# Altium project RadioRepeater.PrjPcb
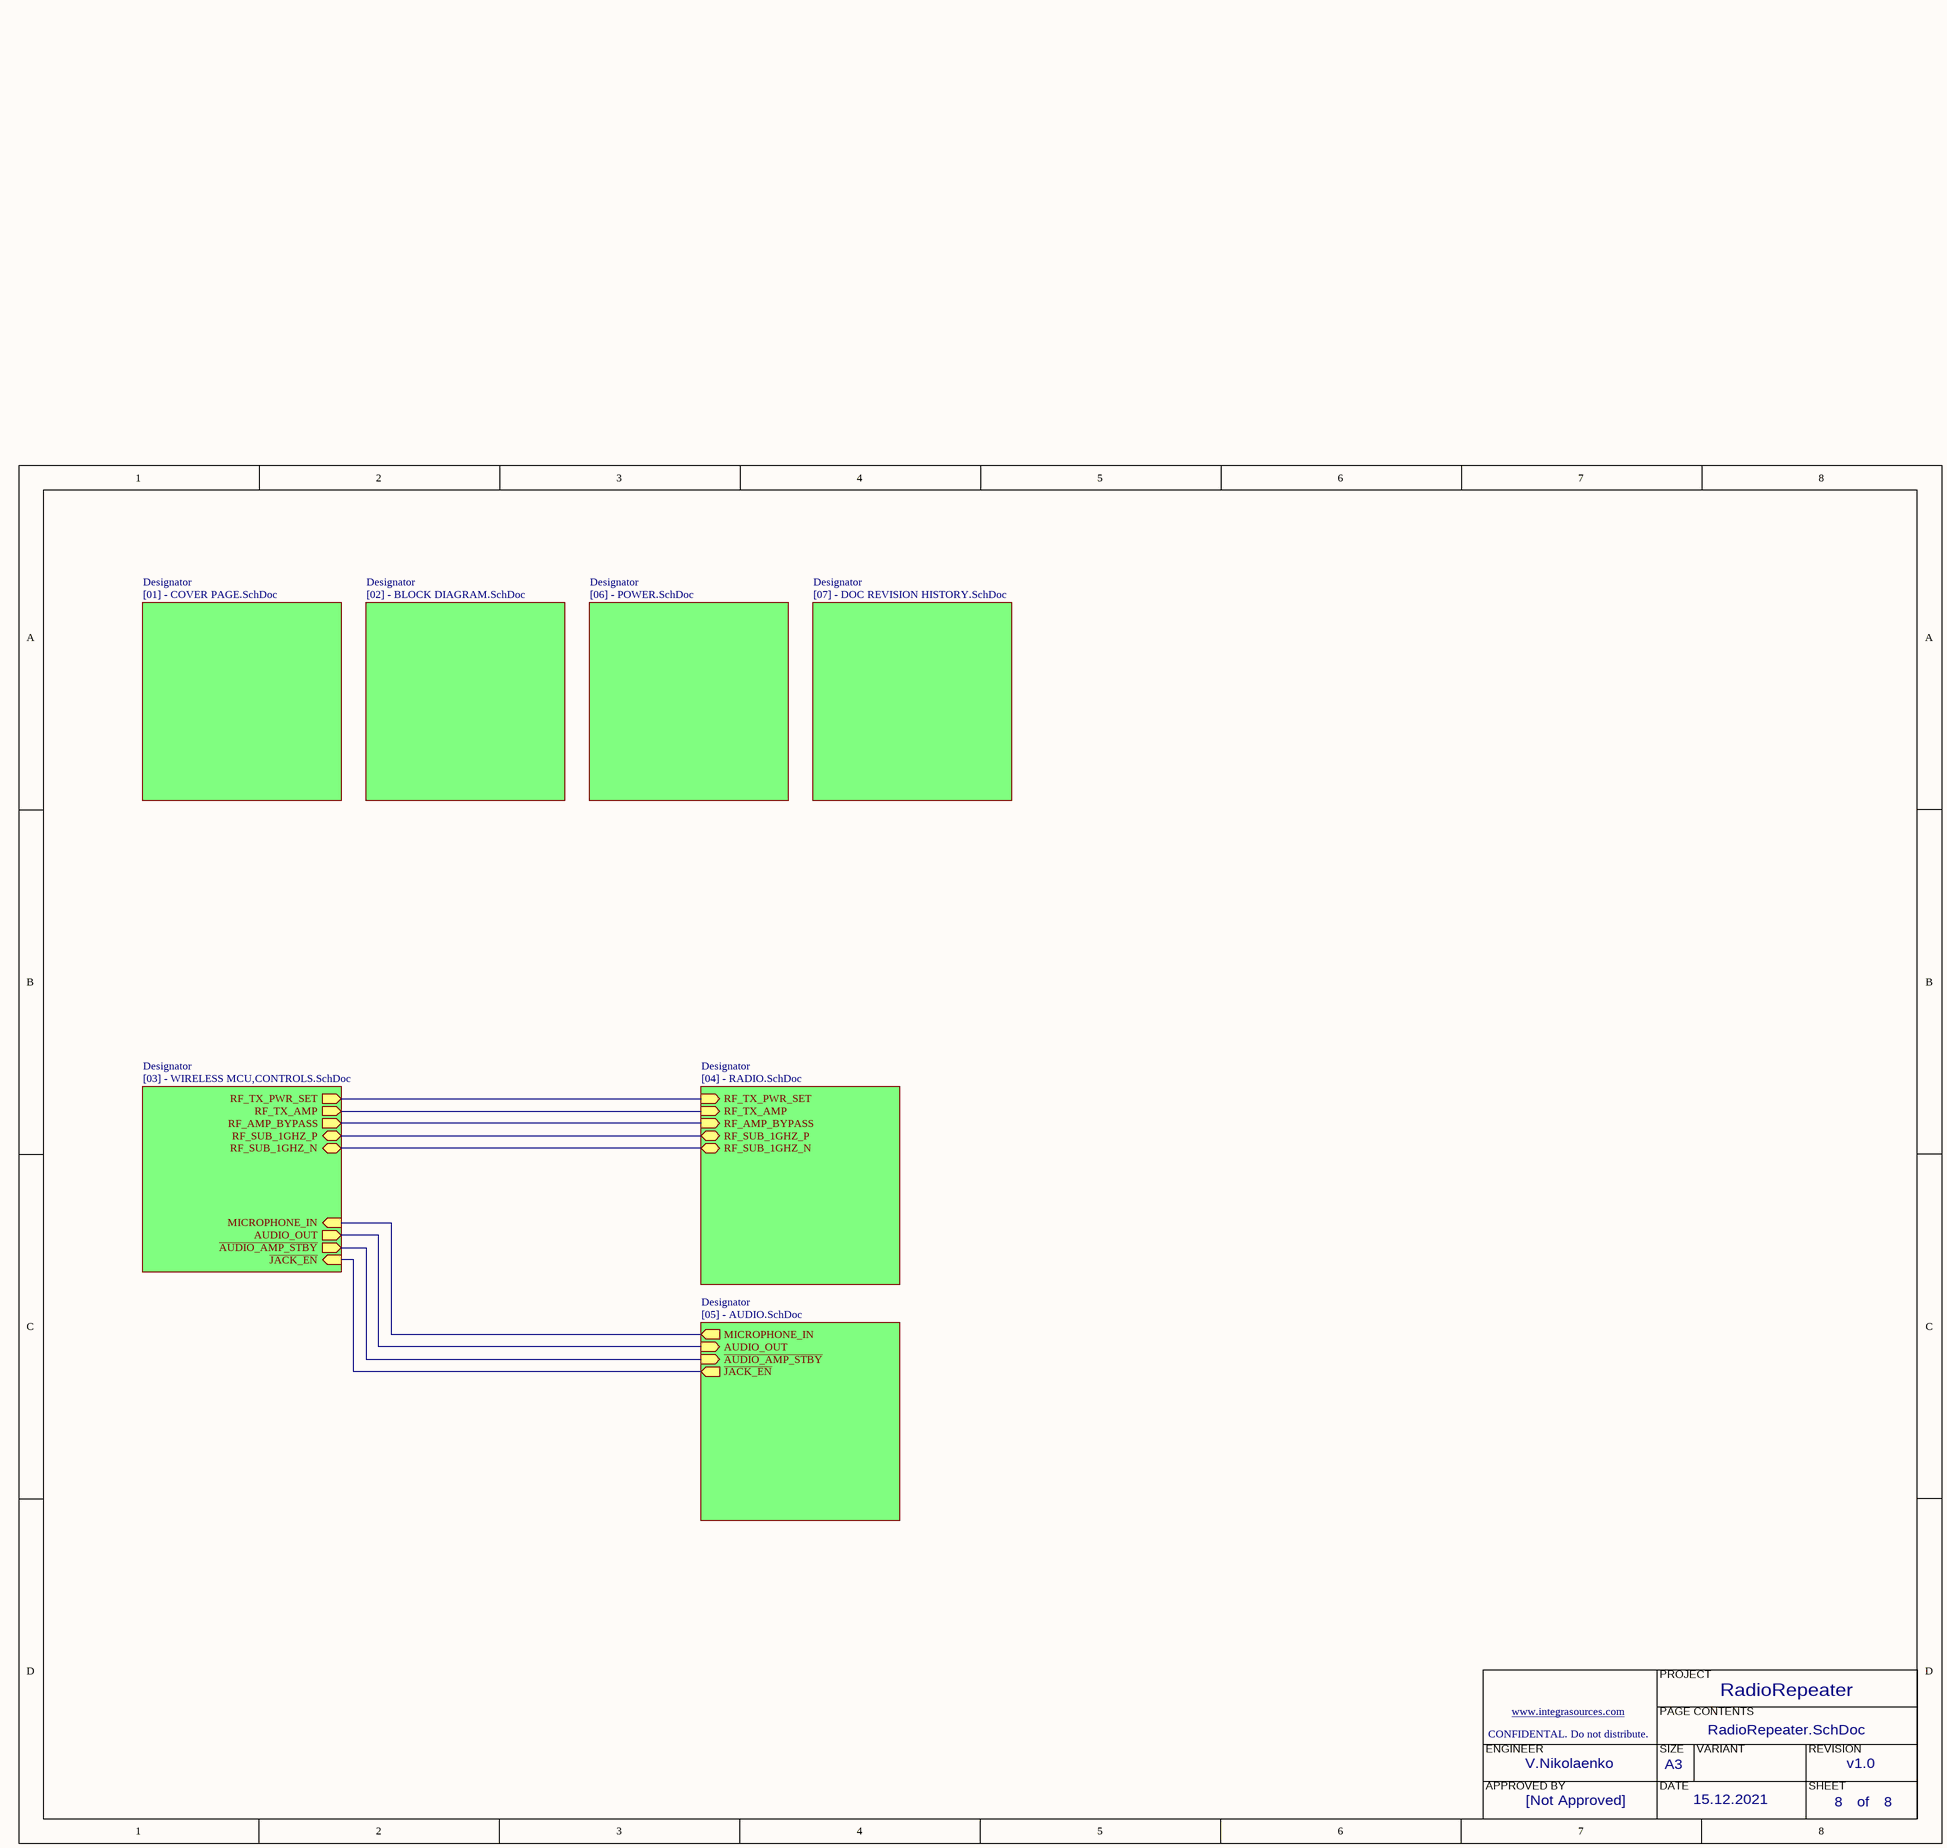
[diagram p0: RadioRepeater.SchDoc]
ApproveedBy: [Not Approved]; Developer: V.Nikolaenko; LastModificationDate: 15.12.2021; Project: RadioRepeater; VersionRevision: v1.0
8 sheets, 182 parts. Net scope: hierarchical (ports join the sheet entries above them; power ports are global).
Board file: RadioRepeater.PcbDoc
Sheets:
  RadioRepeater.SchDoc
    Designator = [01] - COVER PAGE.SchDoc
    Designator = [02] - BLOCK DIAGRAM.SchDoc
    Designator = [07] - DOC REVISION HISTORY.SchDoc
    Designator = [03] - WIRELESS MCU,CONTROLS.SchDoc
    Designator = [04] - RADIO.SchDoc
    Designator = [05] - AUDIO.SchDoc
    Designator = [06] - POWER.SchDoc

## Sheet RadioRepeater.SchDoc
size A3; CompanyName: KDS; Organization: KDS; DocumentNumber: 8; Revision: V1I1; SheetNumber: 8; SheetTotal: 8; PageSetup: Record=PageOptions|CenterHorizontal=True|CenterVertical=True|PrintScale=1.07|XCorrection=1.00|YCorrection=1.00|PrintKind=1|BorderSize=5000000|LeftOffset=0|BottomOffset=0|Orientation=2|PaperLength=1000|PaperWidth=1000|Scale=100|PaperSource=7|PrintQuality=600|MediaType=1|DitherType=10|PaperKind=A3|PrintScaleMode=1; ProjectName: KDS C6A816x Module

### Sub-sheets
Designator = [01] - COVER PAGE.SchDoc: no entries
Designator = [02] - BLOCK DIAGRAM.SchDoc: no entries
Designator = [07] - DOC REVISION HISTORY.SchDoc: no entries
Designator = [03] - WIRELESS MCU,CONTROLS.SchDoc: RF_TX_AMP (out), RF_AMP_BYPASS (out), RF_TX_PWR_SET (out), MICROPHONE_IN (in), AUDIO_OUT (out), ~{AUDIO_AMP_STBY} (out), ~{JACK_EN} (in), RF_SUB_1GHZ_P (bidir), RF_SUB_1GHZ_N (bidir)
Designator = [04] - RADIO.SchDoc: RF_TX_PWR_SET (in), RF_TX_AMP (in), RF_AMP_BYPASS (in), RF_SUB_1GHZ_P (bidir), RF_SUB_1GHZ_N (bidir)
Designator = [05] - AUDIO.SchDoc: MICROPHONE_IN (out), AUDIO_OUT (in), ~{AUDIO_AMP_STBY} (in), ~{JACK_EN} (out)
Designator = [06] - POWER.SchDoc: no entries

### Nets
~{AUDIO_AMP_STBY}: sheet Designator/~{AUDIO_AMP_STBY}, sheet Designator/~{AUDIO_AMP_STBY}
AUDIO_OUT: sheet Designator/AUDIO_OUT, sheet Designator/AUDIO_OUT
JACK_EN: sheet Designator/~{JACK_EN}, sheet Designator/~{JACK_EN}
MICROPHONE_IN: sheet Designator/MICROPHONE_IN, sheet Designator/MICROPHONE_IN
RF_AMP_BYPASS: sheet Designator/RF_AMP_BYPASS, sheet Designator/RF_AMP_BYPASS
RF_SUB_1GHZ_N: sheet Designator/RF_SUB_1GHZ_N, sheet Designator/RF_SUB_1GHZ_N
RF_SUB_1GHZ_P: sheet Designator/RF_SUB_1GHZ_P, sheet Designator/RF_SUB_1GHZ_P
RF_TX_AMP: sheet Designator/RF_TX_AMP, sheet Designator/RF_TX_AMP
RF_TX_PWR_SET: sheet Designator/RF_TX_PWR_SET, sheet Designator/RF_TX_PWR_SET

### Notes on the sheet
- PROJECT
- CONFIDENTAL. Do not distribute.
- www.integrasources.com
- PAGE CONTENTS
- ENGINEER
- APPROVED BY
- SIZE
- DATE
- A3
- VARIANT
- REVISION
- SHEET
- of

## Sheet [01] - COVER PAGE.SchDoc
size A3; DocumentNumber: 1; SheetNumber: 1; SheetTotal: 8
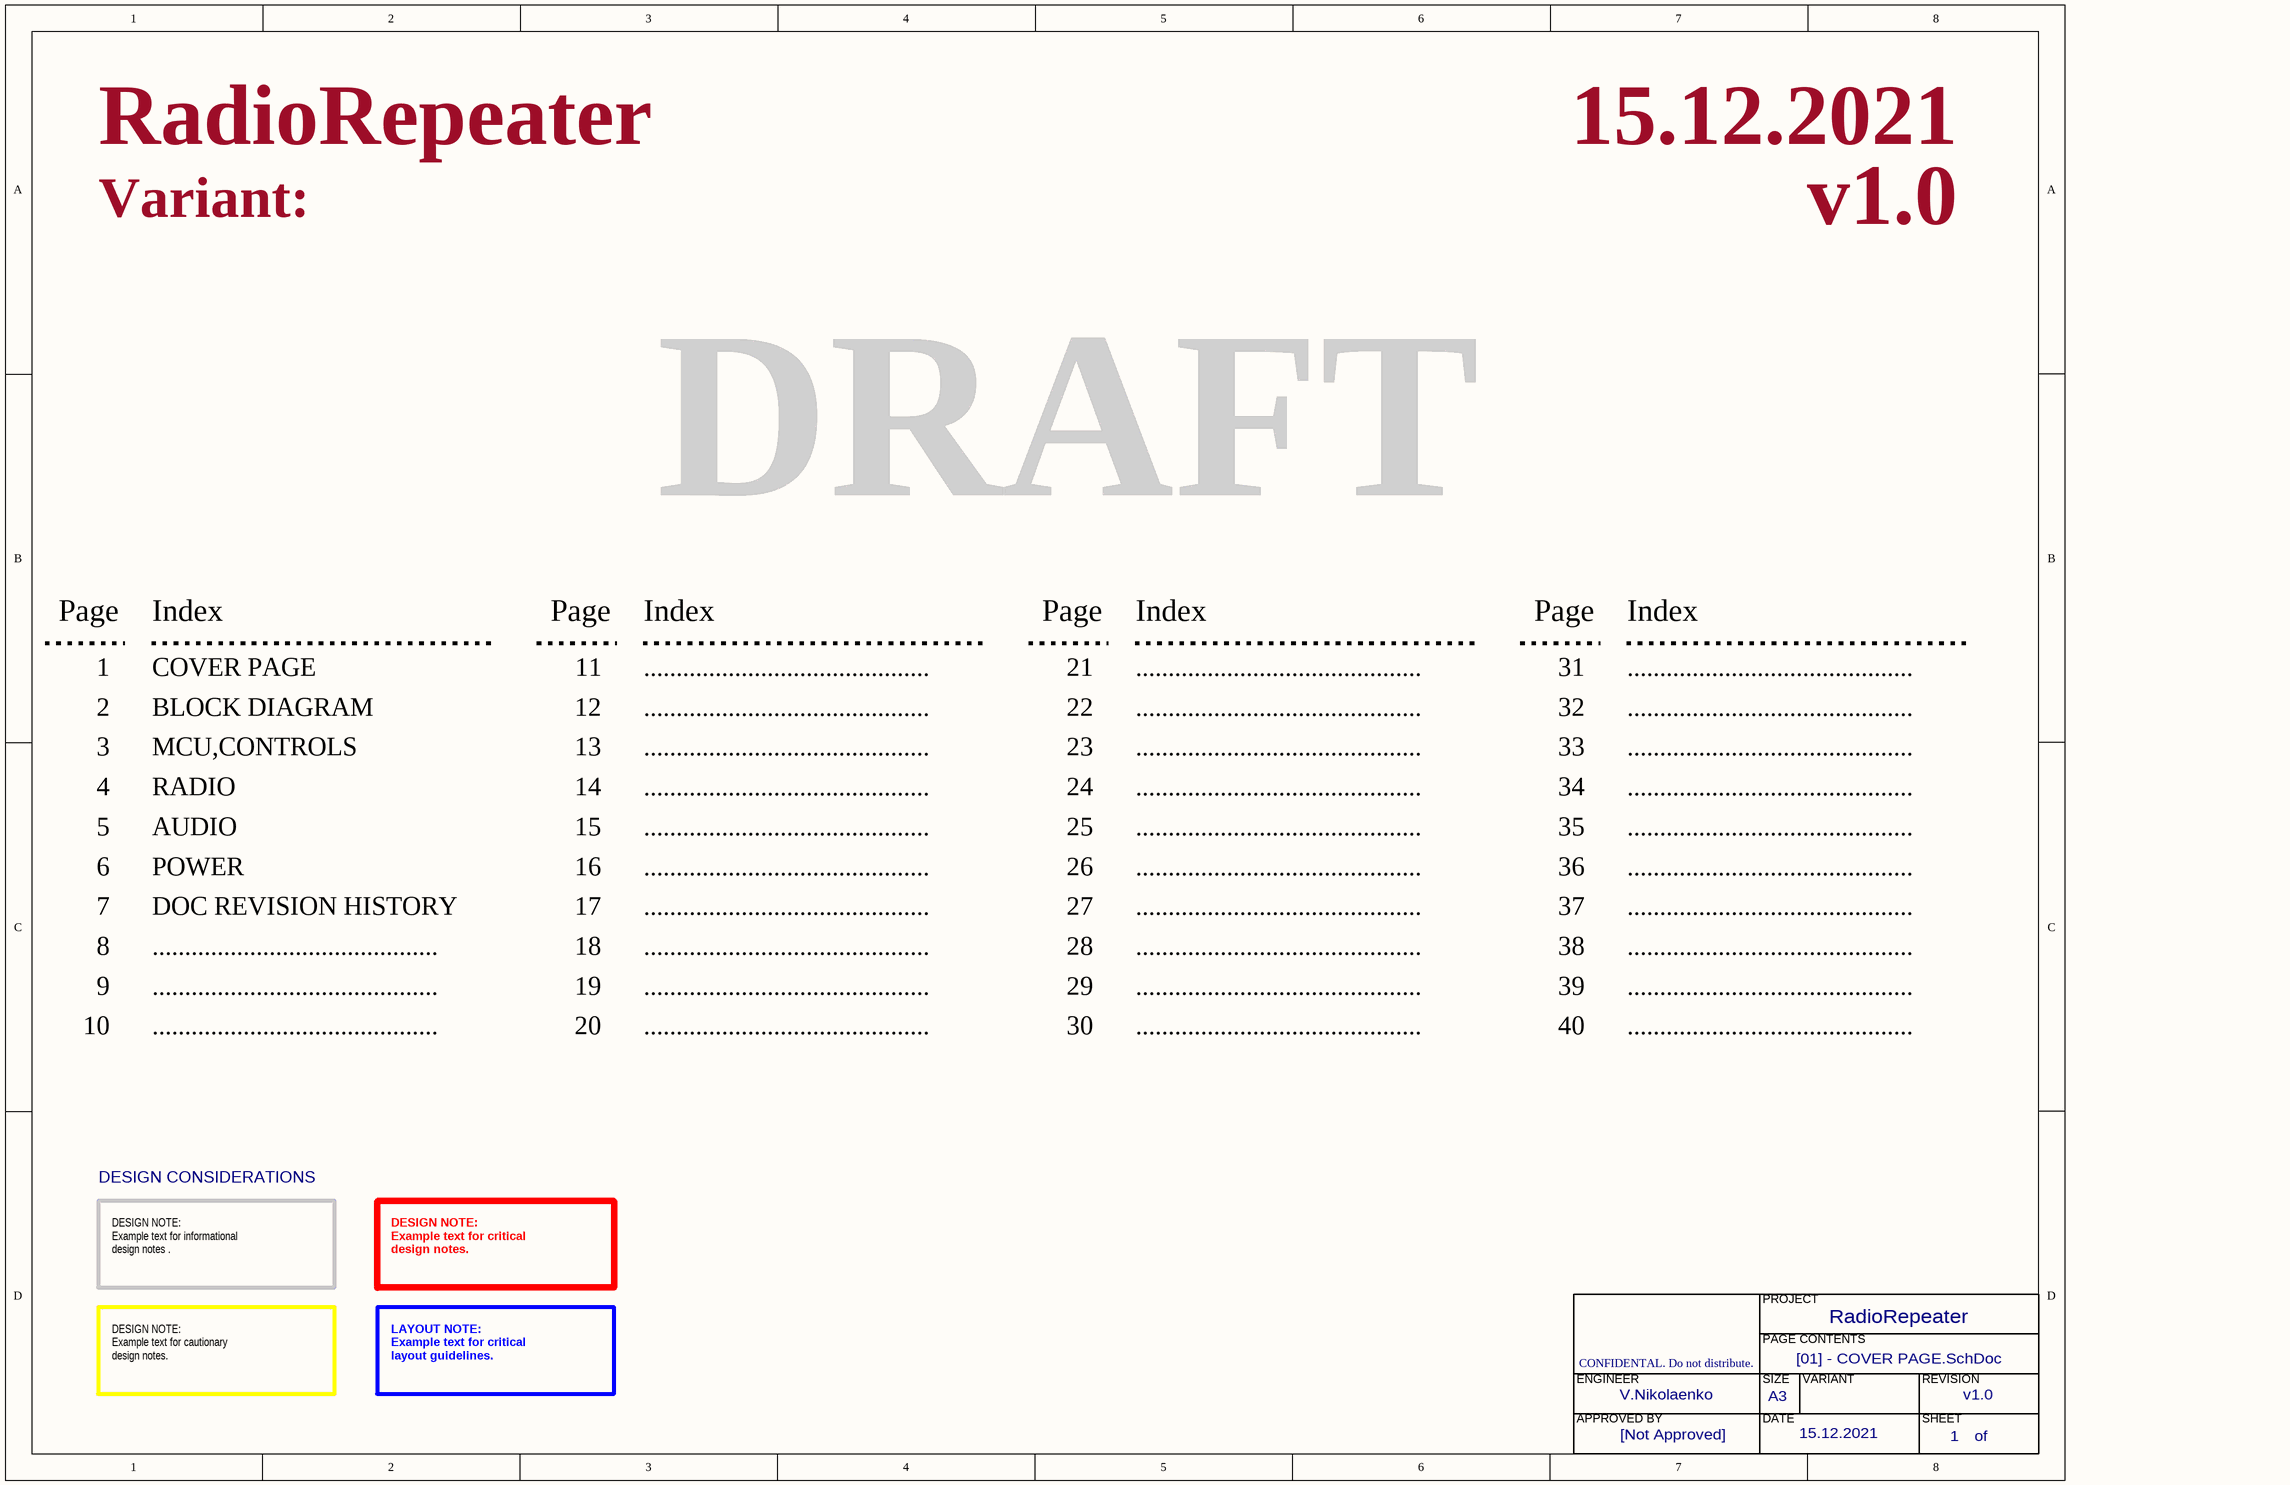
[diagram p1: [01] - COVER PAGE.SchDoc]

### Notes on the sheet
- Variant:
- DRAFT
- Page
- Index
- 1
- COVER PAGE
- 11
- ............................................
- 21
- 31
- 2
- 3
- BLOCK DIAGRAM
- MCU,CONTROLS
- 12
- 13
- 22
- 23
- 32
- 33
- 4
- 5
- RADIO
- AUDIO
- 14
- 15
- 24
- 25
- 34
- 35
- 6
- POWER
- 16
- 26
- 36
- 7
- 8
- DOC REVISION HISTORY
- 17
- 18
- 27
- 28
- 37
- 38
- 9
- 10
- 19
- 20
- 29
- 30
- 39
- 40
- DESIGN CONSIDERATIONS
- DESIGN NOTE:
  Example text for informational
  design notes .
- DESIGN NOTE:
  Example text for critical
  design notes.
- PROJECT
- CONFIDENTAL. Do not distribute.
- PAGE CONTENTS
- DESIGN NOTE:
  Example text for cautionary
  design notes.
- LAYOUT NOTE:
  Example text for critical
  layout guidelines.
- ENGINEER
- APPROVED BY
- SIZE
- DATE
- A3
- VARIANT
- REVISION
- SHEET
- of

## Sheet [02] - BLOCK DIAGRAM.SchDoc
size A3; DocumentNumber: 2; SheetNumber: 2; SheetTotal: 8
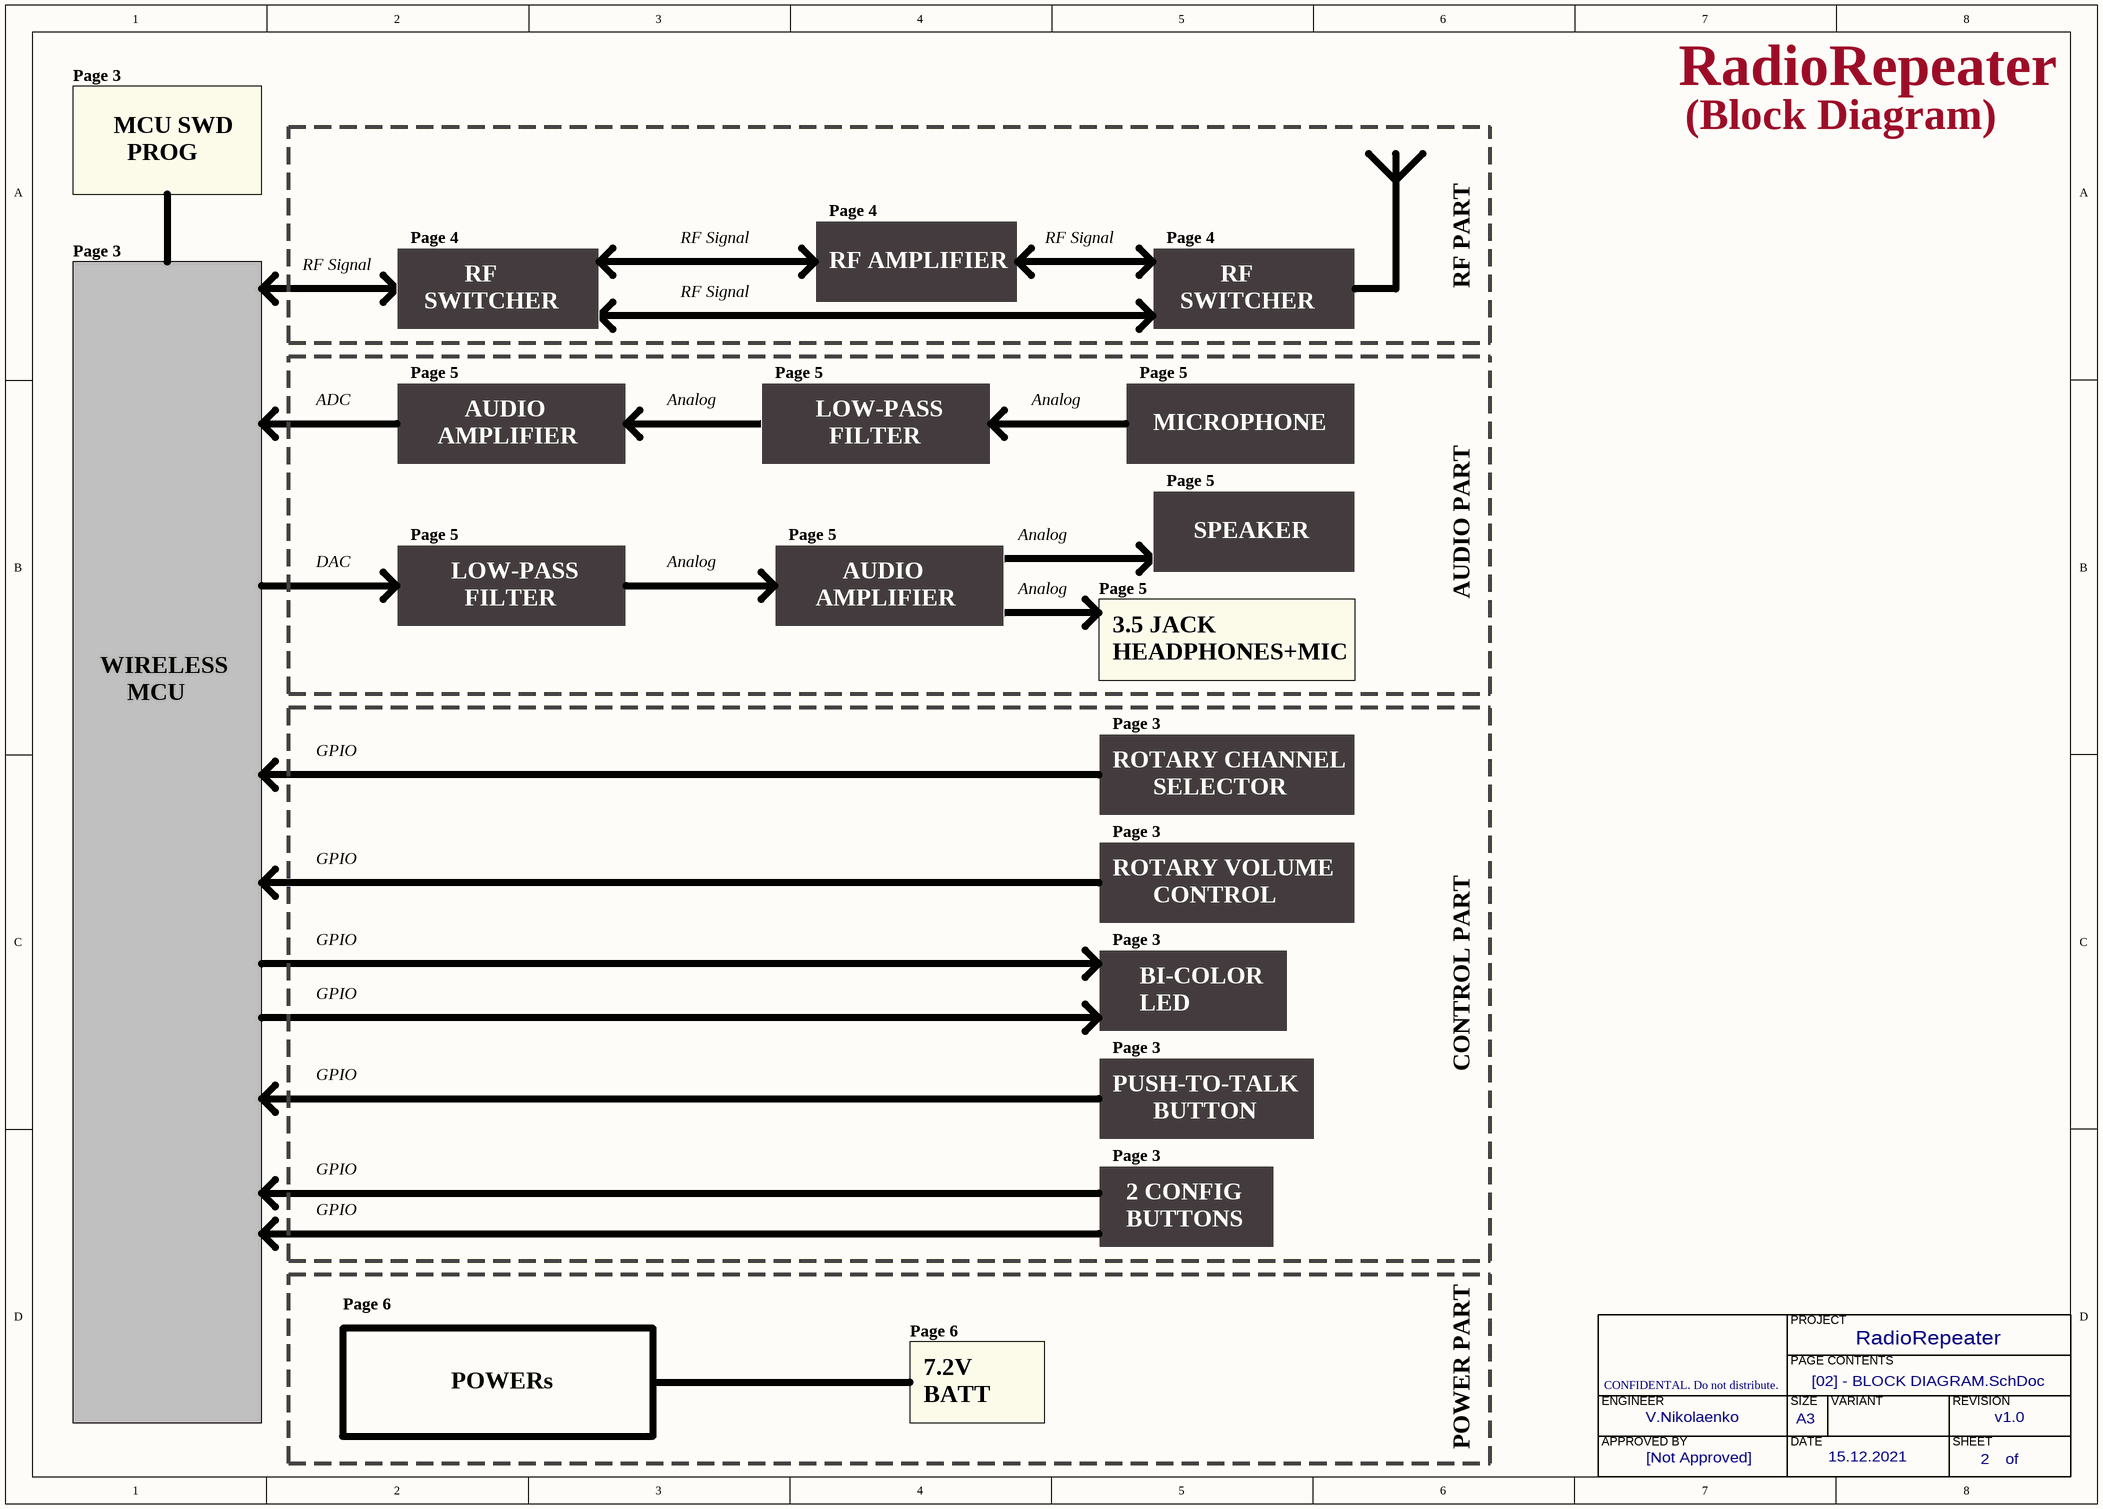
[diagram p2: [02] - BLOCK DIAGRAM.SchDoc]

### Notes on the sheet
- Page 3
- MCU SWD
- PROG
- (Block Diagram)
- Page 4
- RF Signal
- SWITCHER
- RF
- RF AMPLIFIER
- RF PART
- Page 5
- ADC
- AMPLIFIER
- AUDIO
- Analog
- LOW-PASS
- FILTER
- MICROPHONE
- DAC
- SPEAKER
- 3.5 JACK
- AUDIO PART
- WIRELESS
- MCU
- HEADPHONES+MIC
- GPIO
- ROTARY CHANNEL
- SELECTOR
- ROTARY VOLUME
- CONTROL
- BI-COLOR
- LED
- PUSH-TO-TALK
- BUTTON
- CONTROL PART
- 2 CONFIG
- BUTTONS
- Page 6
- PROJECT
- POWERs
- 7.2V
- CONFIDENTAL. Do not distribute.
- PAGE CONTENTS
- BATT
- POWER PART
- ENGINEER
- APPROVED BY
- SIZE
- DATE
- A3
- VARIANT
- REVISION
- SHEET
- of

## Sheet [07] - DOC REVISION HISTORY.SchDoc
size A3; DocumentNumber: 7; SheetNumber: 7; SheetTotal: 8
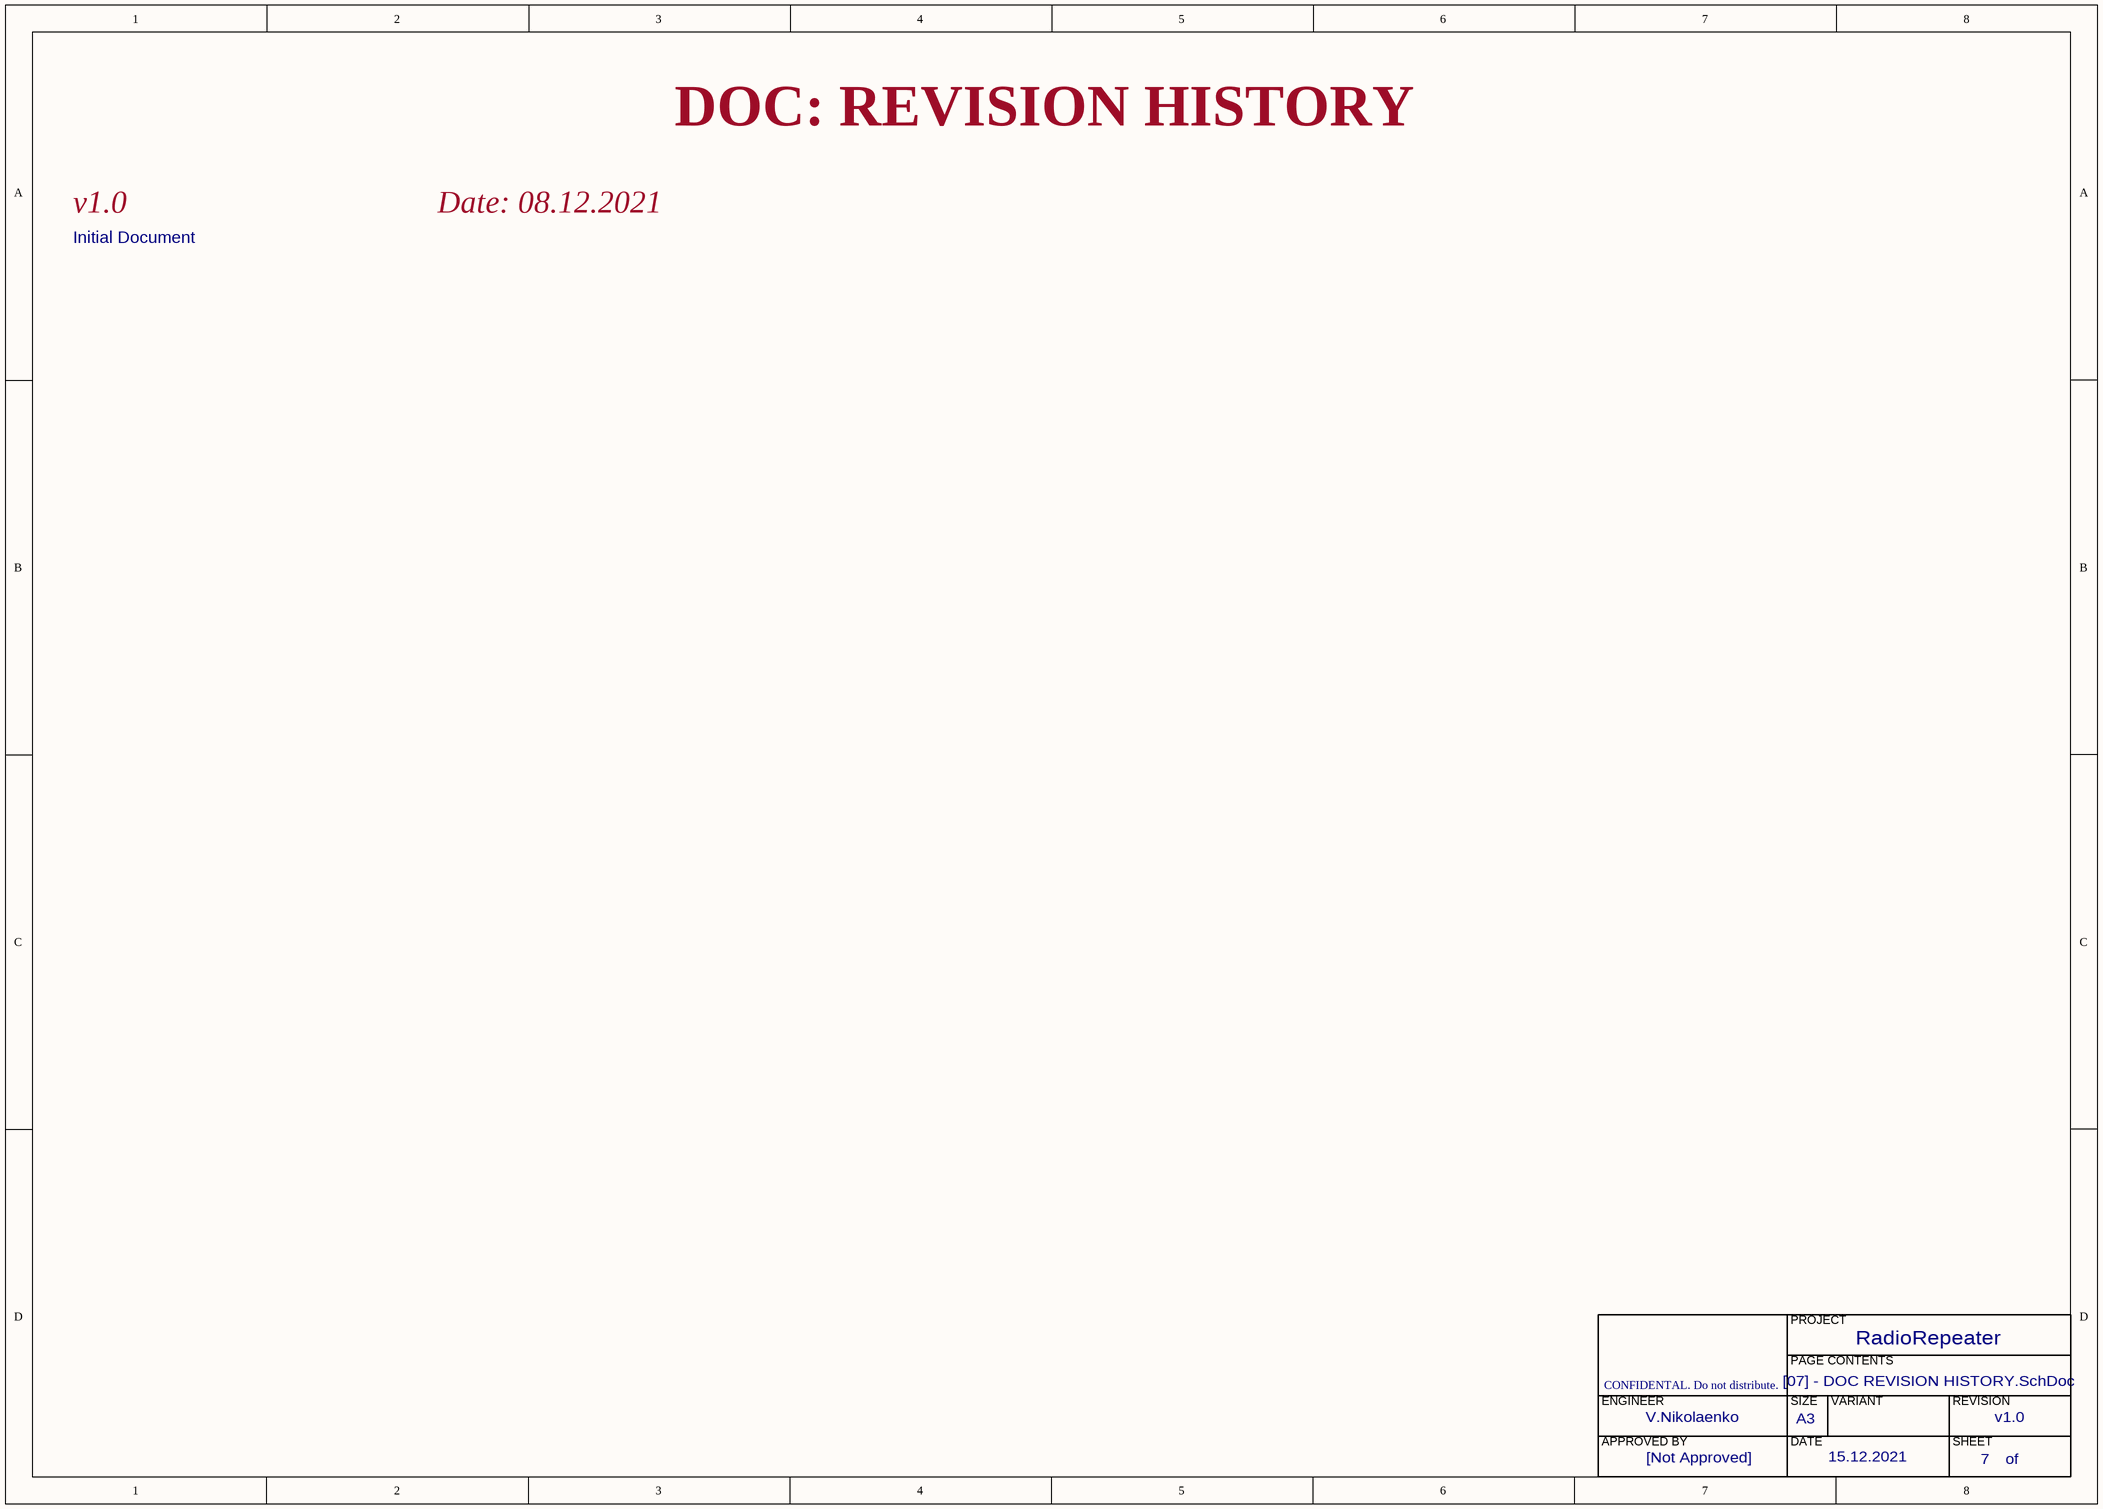
[diagram p3: [07] - DOC REVISION HISTORY.SchDoc]

### Notes on the sheet
- DOC: REVISION HISTORY
- Initial Document
- v1.0
- Date: 08.12.2021
- PROJECT
- CLOCKS (CPU & PCIE)
- CONFIDENTAL. Do not distribute.
- PAGE CONTENTS
- ENGINEER
- APPROVED BY
- SIZE
- DATE
- A3
- VARIANT
- REVISION
- SHEET
- of

## Sheet [03] - WIRELESS MCU,CONTROLS.SchDoc
size A3; DocumentNumber: 3; SheetNumber: 3; SheetTotal: 8
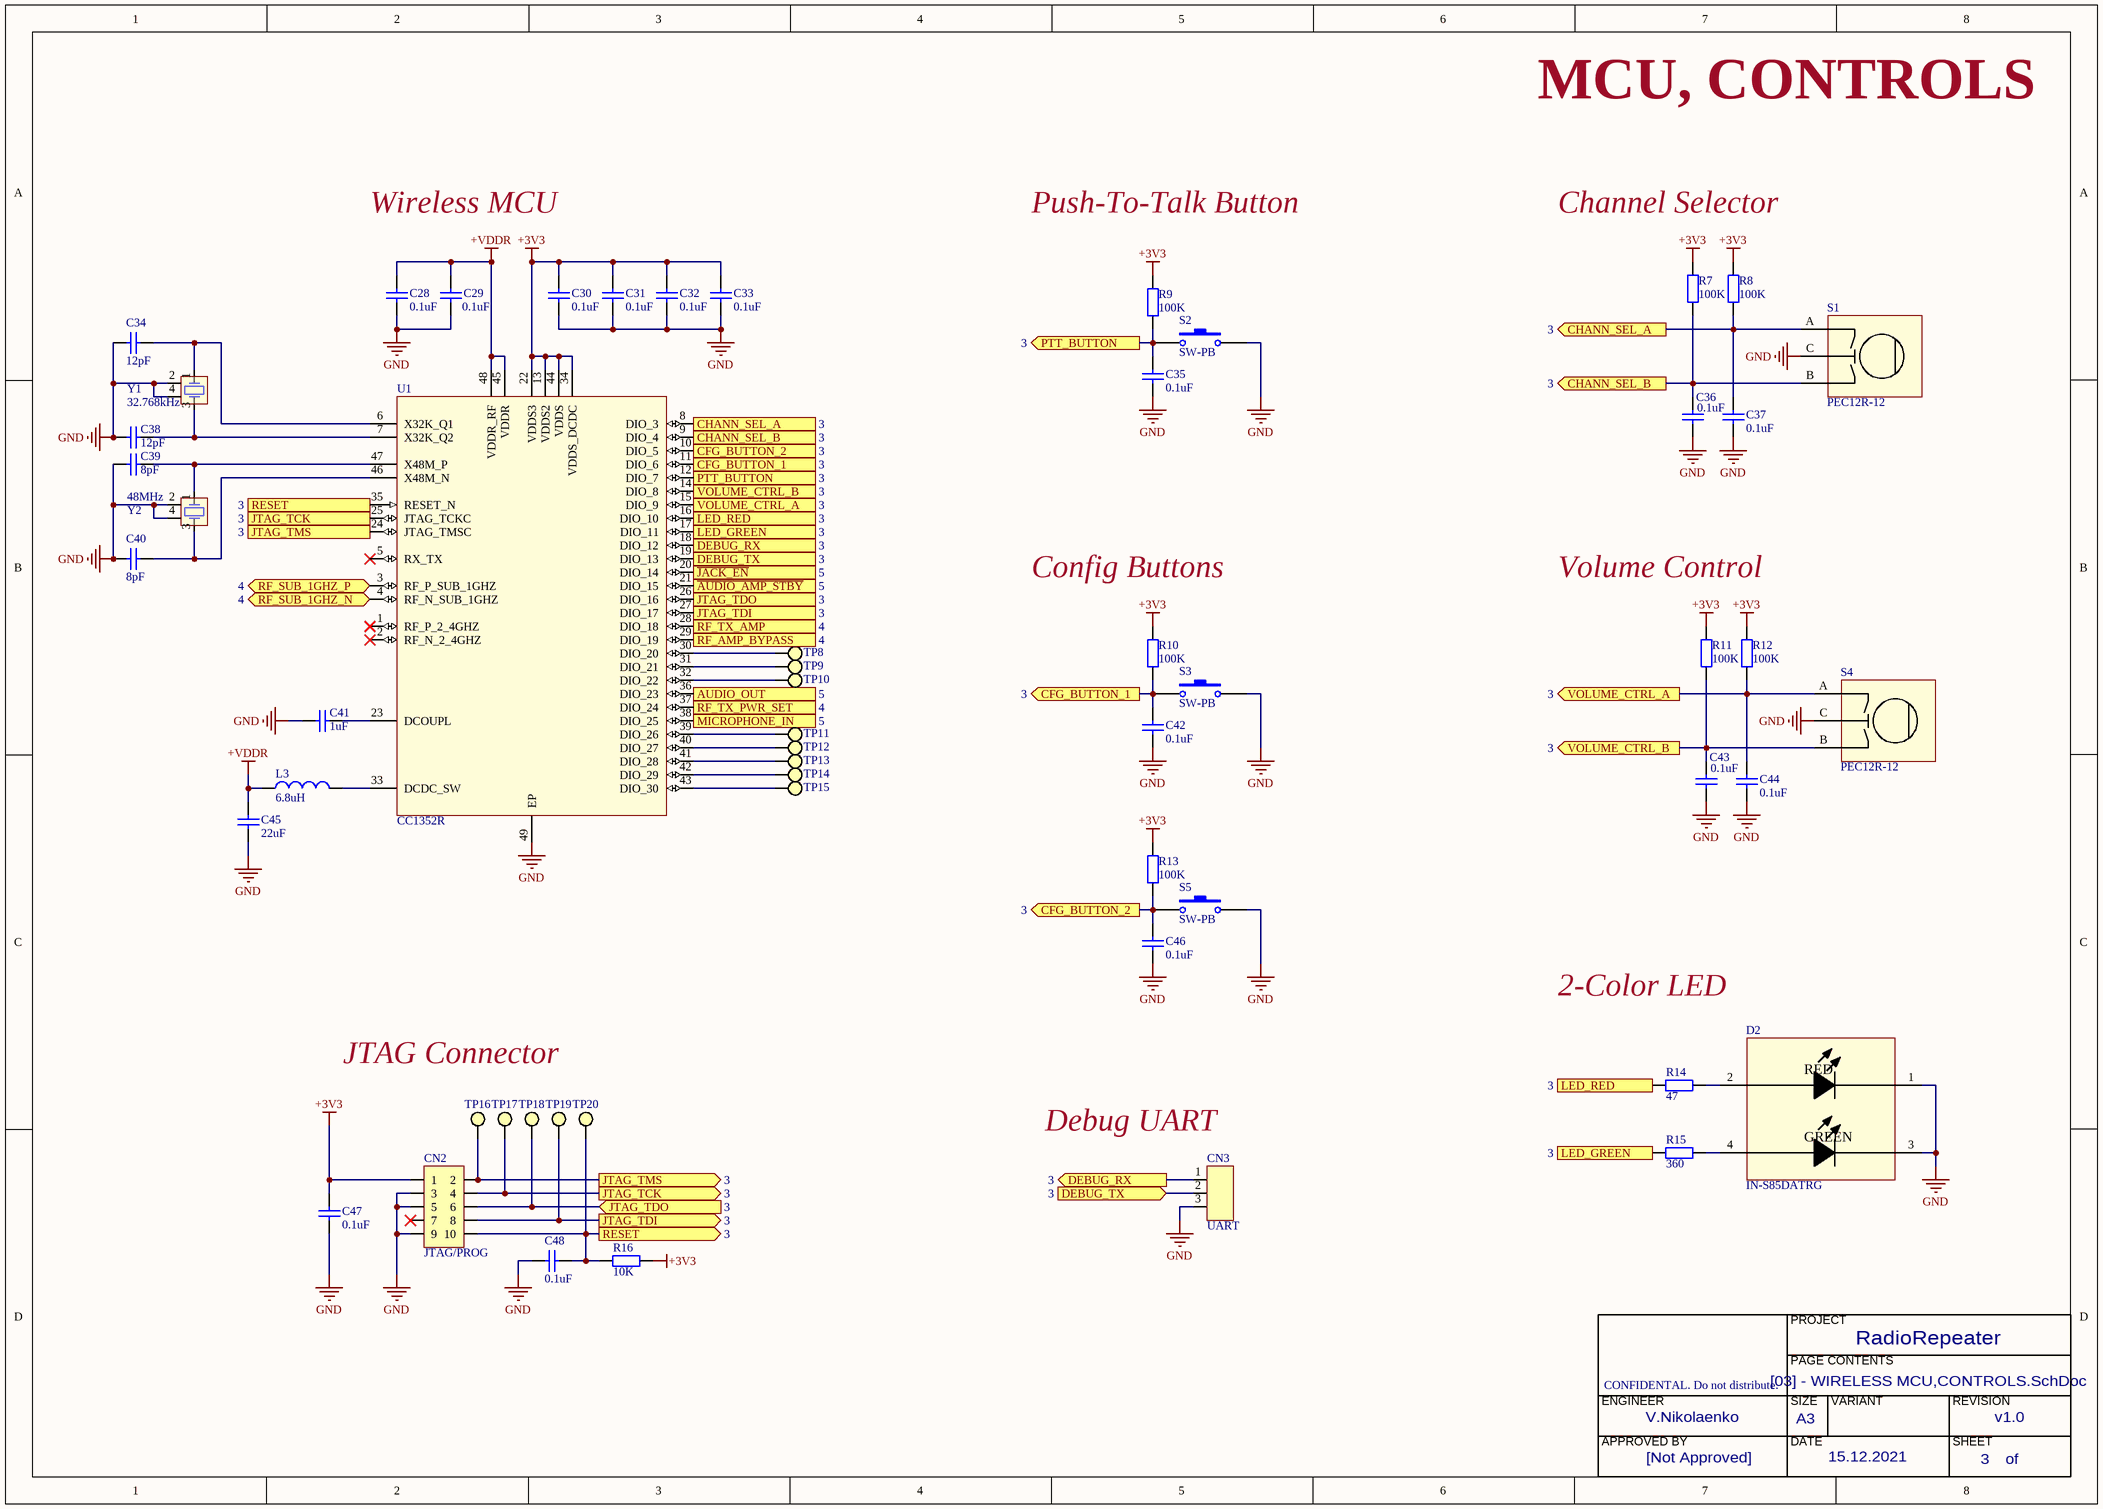
[diagram p4: [03] - WIRELESS MCU,CONTROLS.SchDoc]

### Parts
C28  0.1uF  [CAP0603]
C29  0.1uF  [CAP0603]
C30  0.1uF  [CAP0603]
C31  0.1uF  [CAP0603]
C32  0.1uF  [CAP0603]
C33  0.1uF  [CAP0603]
C34  12pF  [CAP0603]
C35  0.1uF  [CAP0603]
C36  0.1uF  [CAP0603]
C37  0.1uF  [CAP0603]
C38  12pF  [CAP0603]
C39  8pF  [CAP0603]
C40  8pF  [CAP0603]
C41  1uF  [CAP0603]
C42  0.1uF  [CAP0603]
C43  0.1uF  [CAP0603]
C44  0.1uF  [CAP0603]
C45  22uF  [CAP0603]
C46  0.1uF  [CAP0603]
C47  0.1uF  [CAP0603]
C48  0.1uF  [CAP0603]
CN2  JTAG/PROG  [CONN_3220-10-0100-00]
CN3  UART  [H-D-1x3]
D2  IN-S85DATRG  [INS128DATRG]
L3  6.8uH  [INDC0603-0201]
R7  100K  [RES0603]
R8  100K  [RES0603]
R9  100K  [RES0603]
R10  100K  [RES0603]
R11  100K  [RES0603]
R12  100K  [RES0603]
R13  100K  [RES0603]
R14  47  [RES0603]
R15  360  [RES0603]
R16  10K  [RES0603]
S1  PEC12R-12
S2  SW-PB  [ButtonSmall]
S3  SW-PB  [ButtonSmall]
S4  PEC12R-12
S5  SW-PB  [ButtonSmall]
TP8  TestPoint  [TestPoint]  (value not drawn)  (no BOM)
TP9  TestPoint  [TestPoint]  (value not drawn)  (no BOM)
TP10  TestPoint  [TestPoint]  (value not drawn)  (no BOM)
TP11  TestPoint  [TestPoint]  (value not drawn)  (no BOM)
TP12  TestPoint  [TestPoint]  (value not drawn)  (no BOM)
TP13  TestPoint  [TestPoint]  (value not drawn)  (no BOM)
TP14  TestPoint  [TestPoint]  (value not drawn)  (no BOM)
TP15  TestPoint  [TestPoint]  (value not drawn)  (no BOM)
TP16  TestPoint  [TestPoint]  (value not drawn)  (no BOM)
TP17  TestPoint  [TestPoint]  (value not drawn)  (no BOM)
TP18  TestPoint  [TestPoint]  (value not drawn)  (no BOM)
TP19  TestPoint  [TestPoint]  (value not drawn)  (no BOM)
TP20  TestPoint  [TestPoint]  (value not drawn)  (no BOM)
U1  CC1352R  [RGZ0048A]
Y1  32.768kHz  [ABM3B]
Y2  48MHz  [ABM3B]

### Ports
AUDIO_OUT (out, see 5), CFG_BUTTON_1 (in, see 3), CFG_BUTTON_1 (out, see 3), CFG_BUTTON_2 (in, see 3), CFG_BUTTON_2 (out, see 3), CHANN_SEL_A (in, see 3), CHANN_SEL_A (out, see 3), CHANN_SEL_B (in, see 3), CHANN_SEL_B (out, see 3), DEBUG_RX (in, see 3), DEBUG_RX (out, see 3), DEBUG_TX (in, see 3), DEBUG_TX (out, see 3), JTAG_TCK (in, see 3), JTAG_TCK (out, see 3), JTAG_TDI (in, see 3), JTAG_TDI (out, see 3), JTAG_TDO (in, see 3), JTAG_TDO (out, see 3), JTAG_TMS (in, see 3), JTAG_TMS (out, see 3), LED_GREEN (in, see 3), LED_GREEN (out, see 3), LED_RED (in, see 3), LED_RED (out, see 3), MICROPHONE_IN (in, see 5), PTT_BUTTON (in, see 3), PTT_BUTTON (out, see 3), RESET (in, see 3), RESET (out, see 3), RF_AMP_BYPASS (out, see 4), RF_SUB_1GHZ_N (bidir, see 4), RF_SUB_1GHZ_P (bidir, see 4), RF_TX_AMP (out, see 4), RF_TX_PWR_SET (out, see 4), VOLUME_CTRL_A (in, see 3), VOLUME_CTRL_A (out, see 3), VOLUME_CTRL_B (in, see 3), VOLUME_CTRL_B (out, see 3), ~{AUDIO_AMP_STBY} (out, see 5), ~{JACK_EN} (in, see 5)

### Nets
+3V3: C30.1 C31.1 C32.1 C33.1 C47.2 CN2.1 R7.1 R8.2 R9.1 R10.1 R11.1 R12.2 R13.1 R16.2 U1.13(VDDS2) U1.22(VDDS3) U1.34(VDDS_DCDC) U1.44(VDDS)
+VDDR: C28.1 C29.1 C45.2 L3.1 U1.45(VDDR) U1.48(VDDR_RF)
GND: C28.2 C29.2 C30.2 C31.2 C32.2 C33.2 C34.1 C35.1 C36.1 C37.1 C38.1 C39.1 C40.1 C41.2 C42.1 C43.1 C44.1 C45.1 C46.1 C47.1 C48.1 CN2.3 CN2.5 CN2.9 CN3.3 D2.1(C_R) D2.3(C_G) S1.C S2.2 S3.2 S4.C S5.2 U1.49(EP) Y1.2(GND) Y1.4(GND) Y2.2(GND) Y2.4(GND)
~{AUDIO_AMP_STBY}: U1.21(DIO_15) ; port ~{AUDIO_AMP_STBY}
AUDIO_OUT: U1.36(DIO_23) ; port AUDIO_OUT
CFG_BUTTON_1: C42.2 R10.2 S3.1 U1.11(DIO_6) ; port CFG_BUTTON_1
CFG_BUTTON_2: C46.2 R13.2 S5.1 U1.10(DIO_5) ; port CFG_BUTTON_2
CHANN_SEL_A: C37.2 R8.1 S1.A U1.8(DIO_3) ; port CHANN_SEL_A
CHANN_SEL_B: C36.2 R7.2 S1.B U1.9(DIO_4) ; port CHANN_SEL_B
DEBUG_RX: CN3.1 U1.18(DIO_12) ; port DEBUG_RX
DEBUG_TX: CN3.2 U1.19(DIO_13) ; port DEBUG_TX
JACK_EN: U1.20(DIO_14) ; port ~{JACK_EN}
JTAG_TCK: CN2.4 TP17.1 U1.25(JTAG_TCKC) ; port JTAG_TCK
JTAG_TDI: CN2.8 TP19.1 U1.27(DIO_17) ; port JTAG_TDI
JTAG_TDO: CN2.6 TP18.1 U1.26(DIO_16) ; port JTAG_TDO
JTAG_TMS: CN2.2 TP16.1 U1.24(JTAG_TMSC) ; port JTAG_TMS
LED_GREEN: R15.2 U1.17(DIO_11) ; port LED_GREEN
LED_RED: R14.1 U1.16(DIO_10) ; port LED_RED
MICROPHONE_IN: U1.38(DIO_25) ; port MICROPHONE_IN
PTT_BUTTON: C35.2 R9.2 S2.1 U1.12(DIO_7) ; port PTT_BUTTON
RESET: C48.2 CN2.10 R16.1 TP20.1 U1.35(RESET_N) ; port RESET
RF_AMP_BYPASS: U1.29(DIO_19) ; port RF_AMP_BYPASS
RF_SUB_1GHZ_N: U1.4(RF_N_SUB_1GHZ) ; port RF_SUB_1GHZ_N
RF_SUB_1GHZ_P: U1.3(RF_P_SUB_1GHZ) ; port RF_SUB_1GHZ_P
RF_TX_AMP: U1.28(DIO_18) ; port RF_TX_AMP
RF_TX_PWR_SET: U1.37(DIO_24) ; port RF_TX_PWR_SET
VOLUME_CTRL_A: C44.2 R12.1 S4.A U1.15(DIO_9) ; port VOLUME_CTRL_A
VOLUME_CTRL_B: C43.2 R11.2 S4.B U1.14(DIO_8) ; port VOLUME_CTRL_B
NetC34_2: C34.2 U1.6(X32K_Q1) Y1.1(OSC1)
NetC38_2: C38.2 U1.7(X32K_Q2) Y1.3(OSC2)
NetC39_2: C39.2 U1.47(X48M_P) Y2.1(OSC1)
NetC40_2: C40.2 U1.46(X48M_N) Y2.3(OSC2)
NetC41_1: C41.1 U1.23(DCOUPL)
NetD2_2: D2.2(A_R) R14.2
NetD2_4: D2.4(A_G) R15.1
NetL3_2: L3.2 U1.33(DCDC_SW)
NetTP8_1: TP8.1 U1.30(DIO_20)
NetTP9_1: TP9.1 U1.31(DIO_21)
NetTP10_1: TP10.1 U1.32(DIO_22)
NetTP11_1: TP11.1 U1.39(DIO_26)
NetTP12_1: TP12.1 U1.40(DIO_27)
NetTP13_1: TP13.1 U1.41(DIO_28)
NetTP14_1: TP14.1 U1.42(DIO_29)
NetTP15_1: TP15.1 U1.43(DIO_30)

Not connected (* = marked no-connect by the designer): CN2 7*; U1 1(RF_P_2_4GHZ)* 2(RF_N_2_4GHZ)* 5(RX_TX)*

### Notes on the sheet
- MCU, CONTROLS
- Wireless MCU
- Push-To-Talk Button
- Channel Selector
- Config Buttons
- Volume Control
- 2-Color LED
- JTAG Connector
- (near CN3) Debug UART
- PROJECT
- CONFIDENTAL. Do not distribute.
- PAGE CONTENTS
- ENGINEER
- APPROVED BY
- SIZE
- DATE
- A3
- VARIANT
- REVISION
- SHEET
- of
- (in symbol IN-S85DATRG) RED; GREEN

### Library data of the parts
C28-C33 = Cap: Capacitor; Manufacturer: KEMET; Manufacturer Part Number: C0603C104M5RACTU; Description 1: Cap Ceramic 0.1uF 50V X7R 20% SMD 0603 125C T/R; Dielectric Material: Ceramic; Capacitance: 100nF; Tolerance: 20%; Voltage Rating: 50V; Dielectric: X7R; Dissipation Factor: 2.5%; ComponentLink1URL: https://datasheet.ciiva.com/5999/1732731-5999390.pdf?src-supplier=Farnell; ComponentLink1Description: https://datasheet.ciiva.com/5999/1732731-5999390.pdf?src-supplier=Farnell; ComponentLink2URL: https://datasheet.ciiva.com/28645/1851736-28645613.pdf?src-supplier=Element14; ComponentLink2Description: https://datasheet.ciiva.com/28645/1851736-28645613.pdf?src-supplier=Element14; ComponentLink3URL: https://datasheet.ciiva.com/7823/kem-c1002-x7r-smd-7823982.pdf?src-supplier=Element14; ComponentLink3Description: https://datasheet.ciiva.com/7823/kem-c1002-x7r-smd-7823982.pdf?src-supplier=Element14; ComponentLink4URL: http://datasheet.octopart.com/C0603C104J4RACTU-KEMET-datasheet-137357764.pdf?src-supplier=Upverter; ComponentLink4Description: http://datasheet.octopart.com/C0603C104J4RACTU-KEMET-datasheet-137357764.pdf?src-supplier=Upverter; ComponentLink5URL: http://datasheet.octopart.com/C0603C104J4RAC-TU-Kemet-datasheet-5313890.pdf?src-supplier=Farnell; ComponentLink5Description: http://datasheet.octopart.com/C0603C104J4RAC-TU-Kemet-datasheet-5313890.pdf?src-supplier=Farnell; ComponentLink6URL: http://datasheet.octopart.com/C0603C104J4RACTU-Kemet-datasheet-10404442.pdf?src-supplier=Farnell; ComponentLink6Description: http://datasheet.octopart.com/C0603C104J4RACTU-Kemet-datasheet-10404442.pdf?src-supplier=Farnell; ComponentLink7URL: http://datasheet.octopart.com/C0603C104J4RACTU-Kemet-datasheet-10942409.pdf?src-supplier=Farnell; ComponentLink7Description: http://datasheet.octopart.com/C0603C104J4RACTU-Kemet-datasheet-10942409.pdf?src-supplier=Farnell; ComponentLink8URL: http://datasheet.octopart.com/C0603C104J4RACTU-Kemet-datasheet-11992184.pdf?src-supplier=Farnell; ComponentLink8Description: http://datasheet.octopart.com/C0603C104J4RACTU-Kemet-datasheet-11992184.pdf?src-supplier=Farnell; ComponentLink9URL: http://datasheet.octopart.com/C0603C104J4RACTU-Kemet-datasheet-12608295.pdf?src-supplier=Farnell; ComponentLink9Description: http://datasheet.octopart.com/C0603C104J4RACTU-Kemet-datasheet-12608295.pdf?src-supplier=Farnell; ComponentLink10URL: http://datasheet.octopart.com/C0603C104J4RACTU-KEMET-datasheet-101575649.pdf?src-supplier=Farnell; ComponentLink10Description: http://datasheet.octopart.com/C0603C104J4RACTU-KEMET-datasheet-101575649.pdf?src-supplier=Farnell; ComponentLink11URL: http://datasheet.octopart.com/C0603C104J4RACTU-Kemet-datasheet-464.pdf?src-supplier=Allied+Electronics; ComponentLink11Description: http://datasheet.octopart.com/C0603C104J4RACTU-Kemet-datasheet-464.pdf?src-supplier=Allied+Electronics; ComponentLink12URL: http://datasheet.octopart.com/C0603C104J4RAC-TU-Kemet-datasheet-8216256.pdf?src-supplier=Jameco; ComponentLink12Description: http://datasheet.octopart.com/C0603C104J4RAC-TU-Kemet-datasheet-8216256.pdf?src-supplier=Jameco; ComponentLink13URL: http://datasheet.octopart.com/C0603C104J4RAC-TU-Kemet-datasheet-5313836.pdf?src-supplier=Farnell; ComponentLink13Description: http://datasheet.octopart.com/C0603C104J4RAC-TU-Kemet-datasheet-5313836.pdf?src-supplier=Farnell; ComponentLink14URL: http://datasheet.octopart.com/C0603C104J4RAC-TU-Kemet-datasheet-5314449.pdf?src-supplier=Farnell; ComponentLink14Description: http://datasheet.octopart.com/C0603C104J4RAC-TU-Kemet-datasheet-5314449.pdf?src-supplier=Farnell; ComponentLink15URL: http://datasheet.octopart.com/C0603C104J4RAC-TU-Kemet-datasheet-5314627.pdf?src-supplier=Farnell; ComponentLink15Description: http://datasheet.octopart.com/C0603C104J4RAC-TU-Kemet-datasheet-5314627.pdf?src-supplier=Farnell; ComponentLink16URL: http://datasheet.octopart.com/C0603C104J4RAC-TU-Kemet-datasheet-5314837.pdf?src-supplier=Farnell; ComponentLink16Description: http://datasheet.octopart.com/C0603C104J4RAC-TU-Kemet-datasheet-5314837.pdf?src-supplier=Farnell; ComponentLink17URL: http://datasheet.octopart.com/C0603C104J4RAC-TU-Kemet-datasheet-5314969.pdf?src-supplier=Farnell; ComponentLink17Description: http://datasheet.octopart.com/C0603C104J4RAC-TU-Kemet-datasheet-5314969.pdf?src-supplier=Farnell; ComponentLink18URL: http://datasheet.octopart.com/C0603C104J4RAC-TU-Kemet-datasheet-5315946.pdf?src-supplier=Farnell; ComponentLink18Description: http://datasheet.octopart.com/C0603C104J4RAC-TU-Kemet-datasheet-5315946.pdf?src-supplier=Farnell; ComponentLink19URL: http://datasheet.octopart.com/C0603C104J4RAC-TU-Kemet-datasheet-5316294.pdf?src-supplier=Farnell; ComponentLink19Description: http://datasheet.octopart.com/C0603C104J4RAC-TU-Kemet-datasheet-5316294.pdf?src-supplier=Farnell; ComponentLink20URL: http://datasheet.octopart.com/C0603C104J4RAC-TU-Kemet-datasheet-5389132.pdf?src-supplier=Farnell; ComponentLink20Description: http://datasheet.octopart.com/C0603C104J4RAC-TU-Kemet-datasheet-5389132.pdf?src-supplier=Farnell; ComponentLink21URL: http://datasheet.octopart.com/C0603C104J4RAC-TU-Kemet-datasheet-5390537.pdf?src-supplier=Farnell; ComponentLink21Description: http://datasheet.octopart.com/C0603C104J4RAC-TU-Kemet-datasheet-5390537.pdf?src-supplier=Farnell; ComponentLink22URL: http://datasheet.octopart.com/C0603C104J4RAC-TU-Kemet-datasheet-7541751.pdf?src-supplier=Farnell; ComponentLink22Description: http://datasheet.octopart.com/C0603C104J4RAC-TU-Kemet-datasheet-7541751.pdf?src-supplier=Farnell; ComponentLink23URL: http://datasheet.octopart.com/C0603C104J4RAC-TU-Kemet-datasheet-7601896.pdf?src-supplier=Farnell; ComponentLink23Description: http://datasheet.octopart.com/C0603C104J4RAC-TU-Kemet-datasheet-7601896.pdf?src-supplier=Farnell; ComponentLink24URL: http://datasheet.octopart.com/C0603C104J4RAC-TU-Kemet-datasheet-7627733.pdf?src-supplier=Farnell; ComponentLink24Description: http://datasheet.octopart.com/C0603C104J4RAC-TU-Kemet-datasheet-7627733.pdf?src-supplier=Farnell; ComponentLink25URL: http://datasheet.octopart.com/C0603C104J4RAC-TU-Kemet-datasheet-7833651.pdf?src-supplier=Farnell; ComponentLink25Description: http://datasheet.octopart.com/C0603C104J4RAC-TU-Kemet-datasheet-7833651.pdf?src-supplier=Farnell; ComponentLink26URL: http://datasheet.octopart.com/C0603C104J4RAC-TU-Kemet-datasheet-8092359.pdf?src-supplier=Farnell; ComponentLink26Description: http://datasheet.octopart.com/C0603C104J4RAC-TU-Kemet-datasheet-8092359.pdf?src-supplier=Farnell; ComponentLink27URL: http://datasheet.octopart.com/C0603C104J4RAC-TU-Kemet-datasheet-8111010.pdf?src-supplier=Farnell; ComponentLink27Description: http://datasheet.octopart.com/C0603C104J4RAC-TU-Kemet-datasheet-8111010.pdf?src-supplier=Farnell; ComponentLink28URL: http://datasheet.octopart.com/C0603C104J4RACTU-Kemet-datasheet-22084244.pdf?src-supplier=Element14; ComponentLink28Description: http://datasheet.octopart.com/C0603C104J4RACTU-Kemet-datasheet-22084244.pdf?src-supplier=Element14; ComponentLink29URL: http://datasheet.octopart.com/C0603C104J4RACTU-Kemet-datasheet-21389237.pdf?src-supplier=Element14; ComponentLink29Description: http://datasheet.octopart.com/C0603C104J4RACTU-Kemet-datasheet-21389237.pdf?src-supplier=Element14; ComponentLink30URL: http://datasheet.octopart.com/C0603C104J4RACTU-Kemet-datasheet-24570007.pdf?src-supplier=Element14; ComponentLink30Description: http://datasheet.octopart.com/C0603C104J4RACTU-Kemet-datasheet-24570007.pdf?src-supplier=Element14; ComponentLink31URL: http://datasheet.octopart.com/C0603C104J4RACTU-Kemet-datasheet-27203261.pdf?src-supplier=Newark; ComponentLink31Description: http://datasheet.octopart.com/C0603C104J4RACTU-Kemet-datasheet-27203261.pdf?src-supplier=Newark; ComponentLink32URL: http://datasheet.octopart.com/C0603C104J4RACTU-Kemet-datasheet-67830779.pdf?src-supplier=TME; ComponentLink32Description: http://datasheet.octopart.com/C0603C104J4RACTU-Kemet-datasheet-67830779.pdf?src-supplier=TME; ComponentLink33URL: http://datasheet.octopart.com/C0603C104J4RACTU-KEMET-datasheet-84169754.pdf; ComponentLink33Description: http://datasheet.octopart.com/C0603C104J4RACTU-KEMET-datasheet-84169754.pdf; ComponentLink34URL: http://datasheet.octopart.com/C0603C104J4RACTU-KEMET-datasheet-110724412.pdf?src-supplier=Allied+Electronics; ComponentLink34Description: http://datasheet.octopart.com/C0603C104J4RACTU-KEMET-datasheet-110724412.pdf?src-supplier=Allied+Electronics; ComponentLink35URL: http://datasheet.octopart.com/C0603C104J4RACTU-KEMET-datasheet-68331906.pdf?src-supplier=TME; ComponentLink35Description: http://datasheet.octopart.com/C0603C104J4RACTU-KEMET-datasheet-68331906.pdf?src-supplier=TME; Supplier 1: Digi-Key; Supplier Part Number 1: 399-7845-1-ND; Stock: 899636; Pricing 1: 1=0.10000, 10=0.03700, 50=0.02040, 100=0.01660, 500=0.01186, 1000=0.00932 (USD); RoHS: Yes; Mount: Surface Mount,PCB; Case/Package: 0603; Case Code (Metric): 1608; Case Code (Imperial): 0603; Contact Plating: Tin,Matte; Min Operating Temperature: -55°C; Max Operating Temperature: 125°C; Package Quantity: 1; Packaging: Tape and Reel; Voltage Rating (DC): 50V; Termination: SMD/SMT; Length: 1.6mm; Height: 0.8mm; Width: 0.031inch; Thickness: 0.034inch; Lead Pitch: 0.7mm; Depth: 0.8mm; Radiation Hardening: No; REACH SVHC: No SVHC; ComponentLink36URL: http://www.alliedelec.com/m/d/6f3b5eb83d09db50ed28bdc730567b33.pdf?src-supplier=Allied+Electronics; ComponentLink36Description: http://www.alliedelec.com/m/d/6f3b5eb83d09db50ed28bdc730567b33.pdf?src-supplier=Allied+Electronics; ComponentLink37URL: http://www.mouser.com/ds/2/212/KEM_C1002_X7R_SMD-1102033.pdf?src-supplier=Mouser; ComponentLink37Description: http://www.mouser.com/ds/2/212/KEM_C1002_X7R_SMD-1102033.pdf?src-supplier=Mouser; ComponentLink38URL: https://www.verical.com/server-webapp/html/getDatasheet?partID=626892&src-supplier=Verical; ComponentLink38Description: https://www.verical.com/server-webapp/html/getDatasheet?partID=626892&src-supplier=Verical; ComponentLink39URL: http://www.farnell.com/datasheets/2746056.pdf?src-supplier=Farnell; ComponentLink39Description: http://www.farnell.com/datasheets/2746056.pdf?src-supplier=Farnell; ComponentLink40URL: http://components.arrow.com/part/dataview/0323_00313986?src-supplier=Arrow+Europe; ComponentLink40Description: http://components.arrow.com/part/dataview/0323_00313986?src-supplier=Arrow+Europe; ComponentLink41URL: http://components.arrow.com/part/dataview/40911037S8853915N7429?src-supplier=Arrow; ComponentLink41Description: http://components.arrow.com/part/dataview/40911037S8853915N7429?src-supplier=Arrow; ComponentLink42URL: http://capacitoredge.kemet.com/capedge2/DataSheet?pn=C0603C104M5RAC7867&src-supplier=Avnet; ComponentLink42Description: http://capacitoredge.kemet.com/capedge2/DataSheet?pn=C0603C104M5RAC7867&src-supplier=Avnet; ComponentLink43URL: http://capacitoredge.kemet.com/capedge2/DataSheet?pn=C0603C104M5RAC7867&src-supplier=Avnet+Asia; ComponentLink43Description: http://capacitoredge.kemet.com/capedge2/DataSheet?pn=C0603C104M5RAC7867&src-supplier=Avnet+Asia; ComponentLink44URL: http://www.farnell.com/datasheets/2746056.pdf?src-supplier=Element14; ComponentLink44Description: http://www.farnell.com/datasheets/2746056.pdf?src-supplier=Element14; ComponentLink45URL: https://api.kemet.com/component-edge/download/datasheet/C0603C104M5RACTU.pdf?src-supplier=Digi-Key; ComponentLink45Description: https://api.kemet.com/component-edge/download/datasheet/C0603C104M5RACTU.pdf?src-supplier=Digi-Key; ComponentLink46URL: http://www.farnell.com/datasheets/2315113.pdf?src-supplier=Newark; ComponentLink46Description: http://www.farnell.com/datasheets/2315113.pdf?src-supplier=Newark; ComponentLink47URL: http://www.farnell.com/datasheets/1828800.pdf?src-supplier=Newark; ComponentLink47Description: http://www.farnell.com/datasheets/1828800.pdf?src-supplier=Newark; ComponentLink48URL: http://www.farnell.com/datasheets/2746056.pdf?src-supplier=Newark; ComponentLink48Description: http://www.farnell.com/datasheets/2746056.pdf?src-supplier=Newark; ComponentLink49URL: https://www.verical.com/server-webapp/html/getDatasheet?partID=110138&src-supplier=Verical; ComponentLink49Description: https://www.verical.com/server-webapp/html/getDatasheet?partID=110138&src-supplier=Verical
C34-C46 C48 = cap: Multilayer Ceramic Capacitors MLCC - SMD/SMT 50V .1uF X7R 0603 10% Tol; Manufacturer: TDK; Manufacturer Part Number: CGA3E2X5R1H104K080AA; Description 2: CAP CER 0.1UF 100V X7S 0603; Description 1: CAP CER 0.1UF 50V X5R 0603; Capacitance: 100nF; Dielectric: X5R; ComponentLink1URL: https://datasheet.ciiva.com/24216/cga3e2x7r1h102k080aa-265935-24216863.pdf?src-supplier=Mouser; ComponentLink1Description: https://datasheet.ciiva.com/24216/cga3e2x7r1h102k080aa-265935-24216863.pdf?src-supplier=Mouser; ComponentLink2URL: https://datasheet.ciiva.com/46424/1839935-46424223.pdf?src-supplier=Element14; ComponentLink2Description: https://datasheet.ciiva.com/46424/1839935-46424223.pdf?src-supplier=Element14; Features: Soft Termination; Ratings: AEC-Q200; ComponentLink3URL: http://www.mouser.com/ds/2/40/AutoMLCC-777028.pdf?src-supplier=Mouser; ComponentLink3Description: http://www.mouser.com/ds/2/40/AutoMLCC-777028.pdf?src-supplier=Mouser; ComponentLink4URL: http://components.arrow.com/part/dataview/0323_03442275?src-supplier=Arrow+Europe; ComponentLink4Description: http://components.arrow.com/part/dataview/0323_03442275?src-supplier=Arrow+Europe; ComponentLink5URL: http://catalogs.avx.com/SurfaceMount.pdf?src-supplier=Digi-Key; ComponentLink5Description: http://catalogs.avx.com/SurfaceMount.pdf?src-supplier=Digi-Key; ComponentLink6URL: http://www.avx.com/docs/Catalogs/flexiterm.pdf?src-supplier=Future+Electronics; ComponentLink6Description: http://www.avx.com/docs/Catalogs/flexiterm.pdf?src-supplier=Future+Electronics; ComponentLink7URL: https://www.avx.com/docs/Catalogs/flexiterm.pdf?src-supplier=Avnet; ComponentLink7Description: https://www.avx.com/docs/Catalogs/flexiterm.pdf?src-supplier=Avnet; Supplier 2: Digi-Key; Supplier Part Number 2: 445-5202-1-ND; Stock 2: 75283; Pricing 2: 1=0,21000, 10=0,14900, 50=0,08460, 100=0,07000, 500=0,04910, 1000=0,04065 (USD); ComponentLink8URL: https://datasheet.ciiva.com/24219/c1608x7s2a104m080ab-264673-24219216.pdf?src-supplier=Mouser; ComponentLink8Description: https://datasheet.ciiva.com/24219/c1608x7s2a104m080ab-264673-24219216.pdf?src-supplier=Mouser; ComponentLink9URL: https://datasheet.ciiva.com/26919/getdatasheetpartid-756132-26919198.pdf?src-supplier=Verical; ComponentLink9Description: https://datasheet.ciiva.com/26919/getdatasheetpartid-756132-26919198.pdf?src-supplier=Verical; Supplier 1: Digi-Key; Supplier Part Number 1: 445-12498-1-ND; RoHS: Yes; Category: Ceramic Capacitors; Stock 1: 20972; Pricing 1: 1=0,10000, 10=0,07300, 50=0,03960, 100=0,03230, 500=0,02310, 1000=0,01815 (USD); Mount: Surface Mount; Case/Package: 0603; Case Code (Metric): 1608; Case Code (Imperial): 0603; Weight: 7.1E-05oz; Min Operating Temperature: -55°C; Max Operating Temperature: 85°C; Package Quantity: 4000; Packaging: Tape and Reel; Tolerance: 10%; Voltage Rating: 50V; Termination: SMD/SMT; Voltage Rating (DC): 50V; Series: CGA; Length: 0.063inch; Width: 0.8mm; Height: 0.8mm; Thickness: 0.035inch; RoHS Compliant: Yes; ComponentLink10URL: http://www.mouser.com/ds/2/400/lcc_automotive_general_en-843974.pdf?src-supplier=Mouser; ComponentLink10Description: http://www.mouser.com/ds/2/400/lcc_automotive_general_en-843974.pdf?src-supplier=Mouser; ComponentLink11URL: https://product.tdk.com/info/en/documents/chara_sheet/CGA3E2X5R1H104K080AA.pdf?src-supplier=Digi-Key; ComponentLink11Description: https://product.tdk.com/info/en/documents/chara_sheet/CGA3E2X5R1H104K080AA.pdf?src-supplier=Digi-Key; ComponentLink12URL: http://product.tdk.com/en/catalog/datasheets/mlcc_automotive_general_en.pdf?src-supplier=Avnet; ComponentLink12Description: http://product.tdk.com/en/catalog/datasheets/mlcc_automotive_general_en.pdf?src-supplier=Avnet; ComponentLink13URL: https://product.tdk.com/info/en/catalog/datasheets/mlcc_automotive_general_en.pdf?src-supplier=Digi-Key; ComponentLink13Description: https://product.tdk.com/info/en/catalog/datasheets/mlcc_automotive_general_en.pdf?src-supplier=Digi-Key
C47 = cap: Manufacturer: TDK; Manufacturer Part Number: CGA3E2X5R1H104K080AA; Description 1: CAP CER 0.1UF 50V X5R 0603; Capacitance: 100nF; Tolerance: 10%; Voltage Rating: 50V; Dielectric: X5R; ComponentLink1URL: https://datasheet.ciiva.com/24216/cga3e2x7r1h102k080aa-265935-24216863.pdf?src-supplier=Mouser; ComponentLink1Description: https://datasheet.ciiva.com/24216/cga3e2x7r1h102k080aa-265935-24216863.pdf?src-supplier=Mouser; ComponentLink2URL: https://datasheet.ciiva.com/46424/1839935-46424223.pdf?src-supplier=Element14; ComponentLink2Description: https://datasheet.ciiva.com/46424/1839935-46424223.pdf?src-supplier=Element14; ComponentLink3URL: https://datasheet.ciiva.com/24219/c1608x7s2a104m080ab-264673-24219216.pdf?src-supplier=Mouser; ComponentLink3Description: https://datasheet.ciiva.com/24219/c1608x7s2a104m080ab-264673-24219216.pdf?src-supplier=Mouser; ComponentLink4URL: https://datasheet.ciiva.com/26919/getdatasheetpartid-756132-26919198.pdf?src-supplier=Verical; ComponentLink4Description: https://datasheet.ciiva.com/26919/getdatasheetpartid-756132-26919198.pdf?src-supplier=Verical; Supplier 1: Digi-Key; Supplier Part Number 1: 445-12498-1-ND; RoHS: Yes; Category: Ceramic Capacitors; Stock 1: 20972; Pricing 1: 1=0,10000, 10=0,07300, 50=0,03960, 100=0,03230, 500=0,02310, 1000=0,01815 (USD); Mount: Surface Mount; Case/Package: 0603; Case Code (Metric): 1608; Case Code (Imperial): 0603; Weight: 7.1E-05oz; Min Operating Temperature: -55°C; Max Operating Temperature: 85°C; Package Quantity: 4000; Packaging: Tape and Reel; Termination: SMD/SMT; Voltage Rating (DC): 50V; Series: CGA; Length: 0.063inch; Width: 0.8mm; Height: 0.8mm; Thickness: 0.035inch; Ratings: AEC-Q200; RoHS Compliant: Yes; ComponentLink5URL: http://www.mouser.com/ds/2/400/lcc_automotive_general_en-843974.pdf?src-supplier=Mouser; ComponentLink5Description: http://www.mouser.com/ds/2/400/lcc_automotive_general_en-843974.pdf?src-supplier=Mouser; ComponentLink6URL: https://product.tdk.com/info/en/documents/chara_sheet/CGA3E2X5R1H104K080AA.pdf?src-supplier=Digi-Key; ComponentLink6Description: https://product.tdk.com/info/en/documents/chara_sheet/CGA3E2X5R1H104K080AA.pdf?src-supplier=Digi-Key; ComponentLink7URL: http://product.tdk.com/en/catalog/datasheets/mlcc_automotive_general_en.pdf?src-supplier=Avnet; ComponentLink7Description: http://product.tdk.com/en/catalog/datasheets/mlcc_automotive_general_en.pdf?src-supplier=Avnet; ComponentLink8URL: https://product.tdk.com/info/en/catalog/datasheets/mlcc_automotive_general_en.pdf?src-supplier=Digi-Key; ComponentLink8Description: https://product.tdk.com/info/en/catalog/datasheets/mlcc_automotive_general_en.pdf?src-supplier=Digi-Key
CN2 = SWD/PROG: Manufacturer: AMPHENOL ICC (FCI); Manufacturer Part Number: 20021511-00010T4LF; Description 1: Conn Shrouded Header (4 Sides) HDR 10 POS 1.27mm Solder ST Thru-Hole Tube; Supplier 1: Digi-Key; Supplier Part Number 1: 609-5420-ND; RoHS: No; Stock 1: 299; Pricing 1: 1=1,40000, 22=1,22818, 88=1,05966, 440=0,86700, 946=0,77067, 4906=0,67434, 9812=0,64062 (USD); ComponentLink1URL: https://cdn.amphenol-icc.com/media/wysiwyg/files/drawing/20021511.pdf?src-supplier=Digi-Key; ComponentLink1Description: https://cdn.amphenol-icc.com/media/wysiwyg/files/drawing/20021511.pdf?src-supplier=Digi-Key
CN3 = CONN-1x3pin: Connector 1x3; Manufacturer: *; Manufacturer Part Number: *; Supplier 1: Digi-Key; Supplier Part Number 1: *
D2 = IN-S85DATRG: SMD LED 0805 Red, Green; Manufacturer: Inolux; Description 1: Led Green/red Clear 0805 SMD; Color: Green,Red; Lens Color: Clear; Lens Style: Flat; Luminous Intensity: 140mcd; Forward Voltage: 2.2V; Test Current: 20mA; Viewing Angle: 120°; Dominant Wavelength: 522nm; Lens Size: 1.25mm; Supplier 1: Digi-Key; Supplier Part Number 1: 1830-1085-1-ND; Manufacturer Part Number: IN-S85DATRG; RoHS: No; Stock 1: 72542; Pricing 1: 1=0,43000, 10=0,28100, 100=0,18760, 500=0,12974, 1000=0,10812 (USD); Mount: Surface Mount; Case/Package: 0805; Packaging: Tape and Reel; Lens Transparency: Clear; Length: 2mm; Width: 1.25mm; Height: 1.1mm; ComponentLink1URL: http://www.inolux-corp.com/datasheet/SMDLED/Bi-Color%20Top%20View/IN-S85DATRG_V1.0.pdf?src-supplier=Digi-Key; ComponentLink1Description: http://www.inolux-corp.com/datasheet/SMDLED/Bi-Color%20Top%20View/IN-S85DATRG_V1.0.pdf?src-supplier=Digi-Key
L3 = Inductor: DigiKey: *
R7-R16 = res: Manufacturer: Panasonic; Manufacturer Part Number: ERJ-3EKF1002V; Description 1: PANASONIC - ERJ-3EKF1002V. - THICK FILM CHIP RES, 0603, 1%, PRECISION; Resistance: 10kR; Power Rating: 100mW; Tolerance: 1%; Voltage Rating: 75V; Temperature Coefficient: 100ppm/°C; ComponentLink1URL: http://www.vishay.com/docs/28773/crcwce3.pdf?src-supplier=Digi-Key; ComponentLink1Description: http://www.vishay.com/docs/28773/crcwce3.pdf?src-supplier=Digi-Key; ComponentLink2URL: http://components.arrow.com/part/dataview/3984768S7115702N1386?src-supplier=Arrow+Electronics; ComponentLink2Description: http://components.arrow.com/part/dataview/3984768S7115702N1386?src-supplier=Arrow+Electronics; ComponentLink3URL: http://components.arrow.com/part/dataview/0323_02069964?src-supplier=Arrow+Europe; ComponentLink3Description: http://components.arrow.com/part/dataview/0323_02069964?src-supplier=Arrow+Europe; ComponentLink4URL: http://www.jameco.com/Jameco/Products/ProdDS/1987468.pdf?src-supplier=Jameco; ComponentLink4Description: http://www.jameco.com/Jameco/Products/ProdDS/1987468.pdf?src-supplier=Jameco; ComponentLink5URL: http://industrial.panasonic.com/cdbs/www-data/pdf/RDA0000/AOA0000C304.pdf?src-supplier=Farnell; ComponentLink5Description: http://industrial.panasonic.com/cdbs/www-data/pdf/RDA0000/AOA0000C304.pdf?src-supplier=Farnell; ComponentLink6URL: https://industrial.panasonic.com/cdbs/www-data/pdf/RDA0000/DMA0000COL11.pdf?src-supplier=Allied+Electronics; ComponentLink6Description: https://industrial.panasonic.com/cdbs/www-data/pdf/RDA0000/DMA0000COL11.pdf?src-supplier=Allied+Electronics; ComponentLink7URL: https://industrial.panasonic.com/cdbs/www-data/pdf/RDA0000/DMA0000COL11.pdf?src-supplier=RSComponents; ComponentLink7Description: https://industrial.panasonic.com/cdbs/www-data/pdf/RDA0000/DMA0000COL11.pdf?src-supplier=RSComponents; ComponentLink8URL: http://www.farnell.com/datasheets/1911175.pdf?src-supplier=Element14; ComponentLink8Description: http://www.farnell.com/datasheets/1911175.pdf?src-supplier=Element14; Supplier 1: Digi-Key; Supplier Part Number 1: P10.0KHCT-ND; RoHS: Yes; Category: Chip SMD Resistors; Stock 1: 7629588; Pricing 1: 1=0,10000, 10=0,03700, 100=0,01490, 1000=0,00670, 2500=0,00582 (USD); Mount: Surface Mount; Case/Package: 0603; Number of Pins: 2; Case Code (Metric): 1608; Case Code (Imperial): 0603; Contact Plating: Tin; Size Code: 0603; Min Operating Temperature: -55°C; Max Operating Temperature: 155°C; Packaging: Tape and Reel; Package Quantity: 1; Resistor Type: Thick Film; Number of Terminations: 2; Termination: SMD/SMT; Max Power Dissipation: 100mW; Voltage Rating (DC): 75V; Features: Automotive AEC-Q200; Series: ERJ; Resistance Tolerance: 1%; Construction: Rectangular; Technology: THICK FILM; Length: 1.6mm; Width: 0.031inch; Height: 0.45mm; Depth: 0.8mm; Radiation Hardening: No; REACH SVHC: No SVHC; Military Standard: Not; Lead Free: Lead Free; RoHS Compliant: Yes
S2 S3 S5 = SW-PB: Switch; Manufacturer: *; Manufacturer Part Number: *; Supplier 1: Digi-Key; Supplier Part Number 1: *
U1 = CC1352R: Mfr_Name: Texas Instruments; Manufacturer_Part_Number: CC1352P1F3RGZT; Type: DEV; RefDes: RefDes; Copyright: Copyright (C) 2022 Ultra Librarian. All rights reserved.; Digi-Key_Part_Number_1: 296-53598-1-ND; Digi-Key_Part_Number_2: 296-53598-2-ND; Digi-Key_Part_Number_3: 296-53598-6-ND
Y1 Y2 = XTAL_4pin: Crystal Oscillator; DigiKey: *

## Sheet [04] - RADIO.SchDoc
size A3; DocumentNumber: 4; SheetNumber: 4; SheetTotal: 8
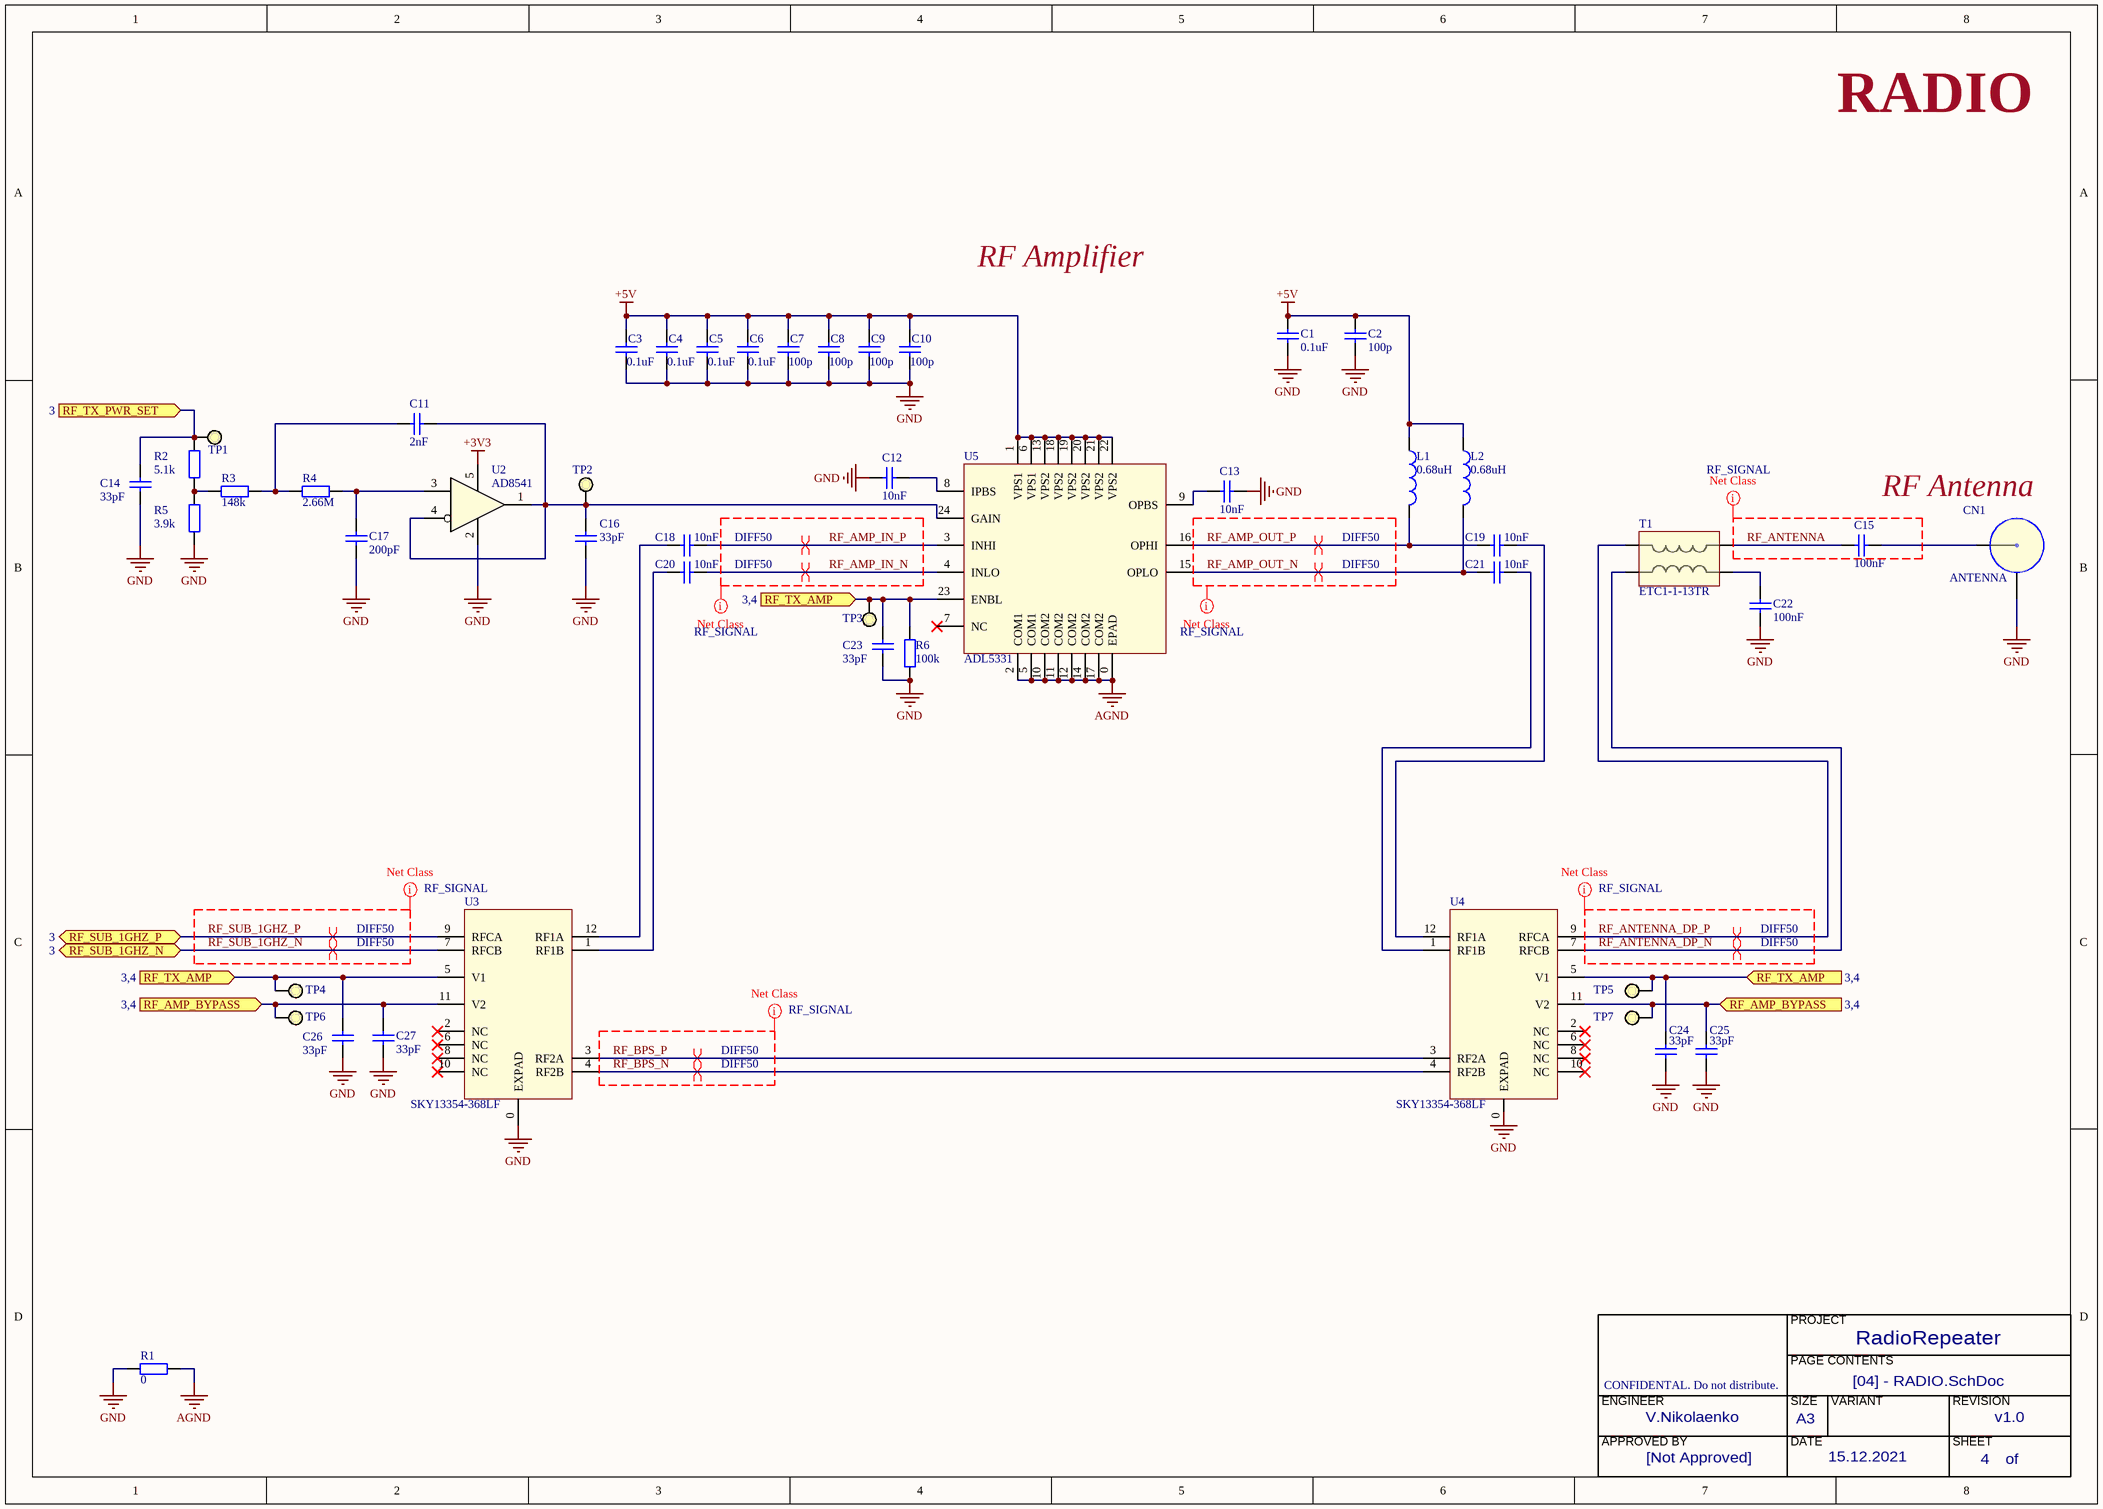
[diagram p5: [04] - RADIO.SchDoc]

### Parts
C1  0.1uF  [CAP0402]
C2  100p  [CAP0402]
C3  0.1uF  [CAP0402]
C4  0.1uF  [CAP0402]
C5  0.1uF  [CAP0402]
C6  0.1uF  [CAP0402]
C7  100p  [CAP0402]
C8  100p  [CAP0402]
C9  100p  [CAP0402]
C10  100p  [CAP0402]
C11  2nF  [CAP0402]
C12  10nF  [CAP0402]
C13  10nF  [CAP0402]
C14  33pF  [CAP0402]
C15  100nF  [CAP0402]
C16  33pF  [CAP0402]
C17  200pF  [CAP0402]
C18  10nF  [CAP0402]
C19  10nF  [CAP0402]
C20  10nF  [CAP0402]
C21  10nF  [CAP0402]
C22  100nF  [CAP0402]
C23  33pF  [CAP0402]
C24  33pF  [CAP0402]
C25  33pF  [CAP0402]
C26  33pF  [CAP0402]
C27  33pF  [CAP0402]
CN1  ANTENNA
L1  0.68uH  [INDC0603-0201]
L2  0.68uH  [INDC0603-0201]
R1  0  [RES0805]
R2  5.1k  [RES0805]
R3  148k  [RES0805]
R4  2.66M  [RES0805]
R5  3.9k  [RES0805]
R6  100k  [RES0805]
T1  ETC1-1-13TR
TP1  TestPoint  [TestPoint]  (value not drawn)  (no BOM)
TP2  TestPoint  [TestPoint]  (value not drawn)  (no BOM)
TP3  TestPoint  [TestPoint]  (value not drawn)  (no BOM)
TP4  TestPoint  [TestPoint]  (value not drawn)  (no BOM)
TP5  TestPoint  [TestPoint]  (value not drawn)  (no BOM)
TP6  TestPoint  [TestPoint]  (value not drawn)  (no BOM)
TP7  TestPoint  [TestPoint]  (value not drawn)  (no BOM)
U2  AD8541  [SOT23-5_PITCH0.95]
U3  SKY13354-368LF
U4  SKY13354-368LF
U5  ADL5331

### Ports
RF_AMP_BYPASS (in, see 3,4), RF_SUB_1GHZ_N (bidir, see 3), RF_SUB_1GHZ_P (bidir, see 3), RF_TX_AMP (in, see 3,4), RF_TX_PWR_SET (in, see 3)

### Nets
+3V3: U2.5(VCC+)
+5V: C1.1 C2.1 C3.1 C4.1 C5.1 C6.1 C7.1 C8.1 C9.1 C10.1 L1.1 L2.1 U5.1(VPS1) U5.6(VPS1) U5.13(VPS2) U5.18(VPS2) U5.19(VPS2) U5.20(VPS2) U5.21(VPS2) U5.22(VPS2)
AGND: R1.1 U5.0(EPAD) U5.2(COM1) U5.5(COM1) U5.10(COM2) U5.11(COM2) U5.12(COM2) U5.14(COM2) U5.17(COM2)
GND: C1.2 C2.2 C3.2 C4.2 C5.2 C6.2 C7.2 C8.2 C9.2 C10.2 C12.1 C13.1 C14.1 C16.1 C17.1 C22.1 C23.1 C24.1 C25.1 C26.1 C27.1 CN1.14 R1.2 R5.2 R6.1 U2.2(VCC-) U3.0(EXPAD)
RF_AMP_BYPASS: C25.2 C27.2 TP6.1 TP7.1 U3.11(V2) U4.11(V2) ; port RF_AMP_BYPASS
RF_AMP_IN_N: C20.1 U5.4(INLO)  [project net RF_AMP_IN_N_4]
RF_AMP_IN_P: C18.1 U5.3(INHI)  [project net RF_AMP_IN_P_4]
RF_AMP_OUT_N: C21.2 L2.2 U5.15(OPLO)  [project net RF_AMP_OUT_N_4]
RF_AMP_OUT_P: C19.2 L1.2 U5.16(OPHI)  [project net RF_AMP_OUT_P_4]
RF_ANTENNA: C15.2 T1.1(UP)  [project net RF_ANTENNA_4]
RF_ANTENNA_DP_N: T1.4(BP) U4.7(RFCB)  [project net RF_ANTENNA_DP_N_4]
RF_ANTENNA_DP_P: T1.3(BP) U4.9(RFCA)  [project net RF_ANTENNA_DP_P_4]
RF_BPS_N: U3.4(RF2B) U4.4(RF2B)  [project net RF_BPS_N_4]
RF_BPS_P: U3.3(RF2A) U4.3(RF2A)  [project net RF_BPS_P_4]
RF_SUB_1GHZ_N: U3.7(RFCB) ; port RF_SUB_1GHZ_N
RF_SUB_1GHZ_P: U3.9(RFCA) ; port RF_SUB_1GHZ_P
RF_TX_AMP: C23.2 C24.2 C26.2 R6.2 TP3.1 TP4.1 TP5.1 U3.5(V1) U4.5(V1) U5.23(ENBL) ; port RF_TX_AMP
RF_TX_PWR_SET: C14.2 R2.1 TP1.1 ; port RF_TX_PWR_SET
NetC11_1: C11.1 C16.2 TP2.1 U2.1(OUT) U2.4(IN-) U5.24(GAIN)
NetC11_2: C11.2 R3.1 R4.2
NetC12_2: C12.2 U5.8(IPBS)
NetC13_2: C13.2 U5.9(OPBS)
NetC15_1: C15.1 CN1.14
NetC17_2: C17.2 R4.1 U2.3(IN+)
NetC18_2: C18.2 U3.12(RF1A)
NetC19_1: C19.1 U4.12(RF1A)
NetC20_2: C20.2 U3.1(RF1B)
NetC21_1: C21.1 U4.1(RF1B)
NetC22_2: C22.2 T1.2(GND)
NetR2_2: R2.2 R3.2 R5.1

Not connected (* = marked no-connect by the designer): U3 2(NC)* 6(NC)* 8(NC)* 10(NC)*; U4 0(EXPAD) 2(NC)* 6(NC)* 8(NC)* 10(NC)*; U5 7(NC)*

### Layout directives
differential pair; net class DIFF50: RF_AMP_IN_N_4, RF_AMP_IN_P_4, RF_AMP_OUT_N_4, RF_AMP_OUT_P_4, RF_ANTENNA_DP_N_4, RF_ANTENNA_DP_P_4, RF_BPS_N_4, RF_BPS_P_4, RF_SUB_1GHZ_N, RF_SUB_1GHZ_P
net class RF_SIGNAL: RF_AMP_IN_N, RF_AMP_IN_P, RF_AMP_OUT_N, RF_AMP_OUT_P, RF_ANTENNA, RF_ANTENNA_DP_N, RF_ANTENNA_DP_P, RF_BPS_N, RF_BPS_P, RF_SUB_1GHZ_N, RF_SUB_1GHZ_P

### Notes on the sheet
- RADIO
- RF Amplifier
- RF Antenna
- PROJECT
- CONFIDENTAL. Do not distribute.
- PAGE CONTENTS
- ENGINEER
- APPROVED BY
- SIZE
- DATE
- A3
- VARIANT
- REVISION
- SHEET
- of
- Labels drawn without touching a wire or pin: GND

### Library data of the parts
C1-C27 = Cap: Capacitor; Manufacturer: *; Manufacturer Part Number: *; Supplier 1: Digi-Key; Supplier Part Number 1: *
CN1 = SMC
L1 L2 = Inductor: DigiKey: *
R1-R6 = Res: Resistor; Manufacturer: *; Manufacturer Part Number: *; Supplier 1: Digi-Key; Supplier Part Number 1: *
T1 = balun_0433BM15A0001E
U2 = OPAMP x1

## Sheet [05] - AUDIO.SchDoc
size A3; DocumentNumber: 5; SheetNumber: 5; SheetTotal: 8
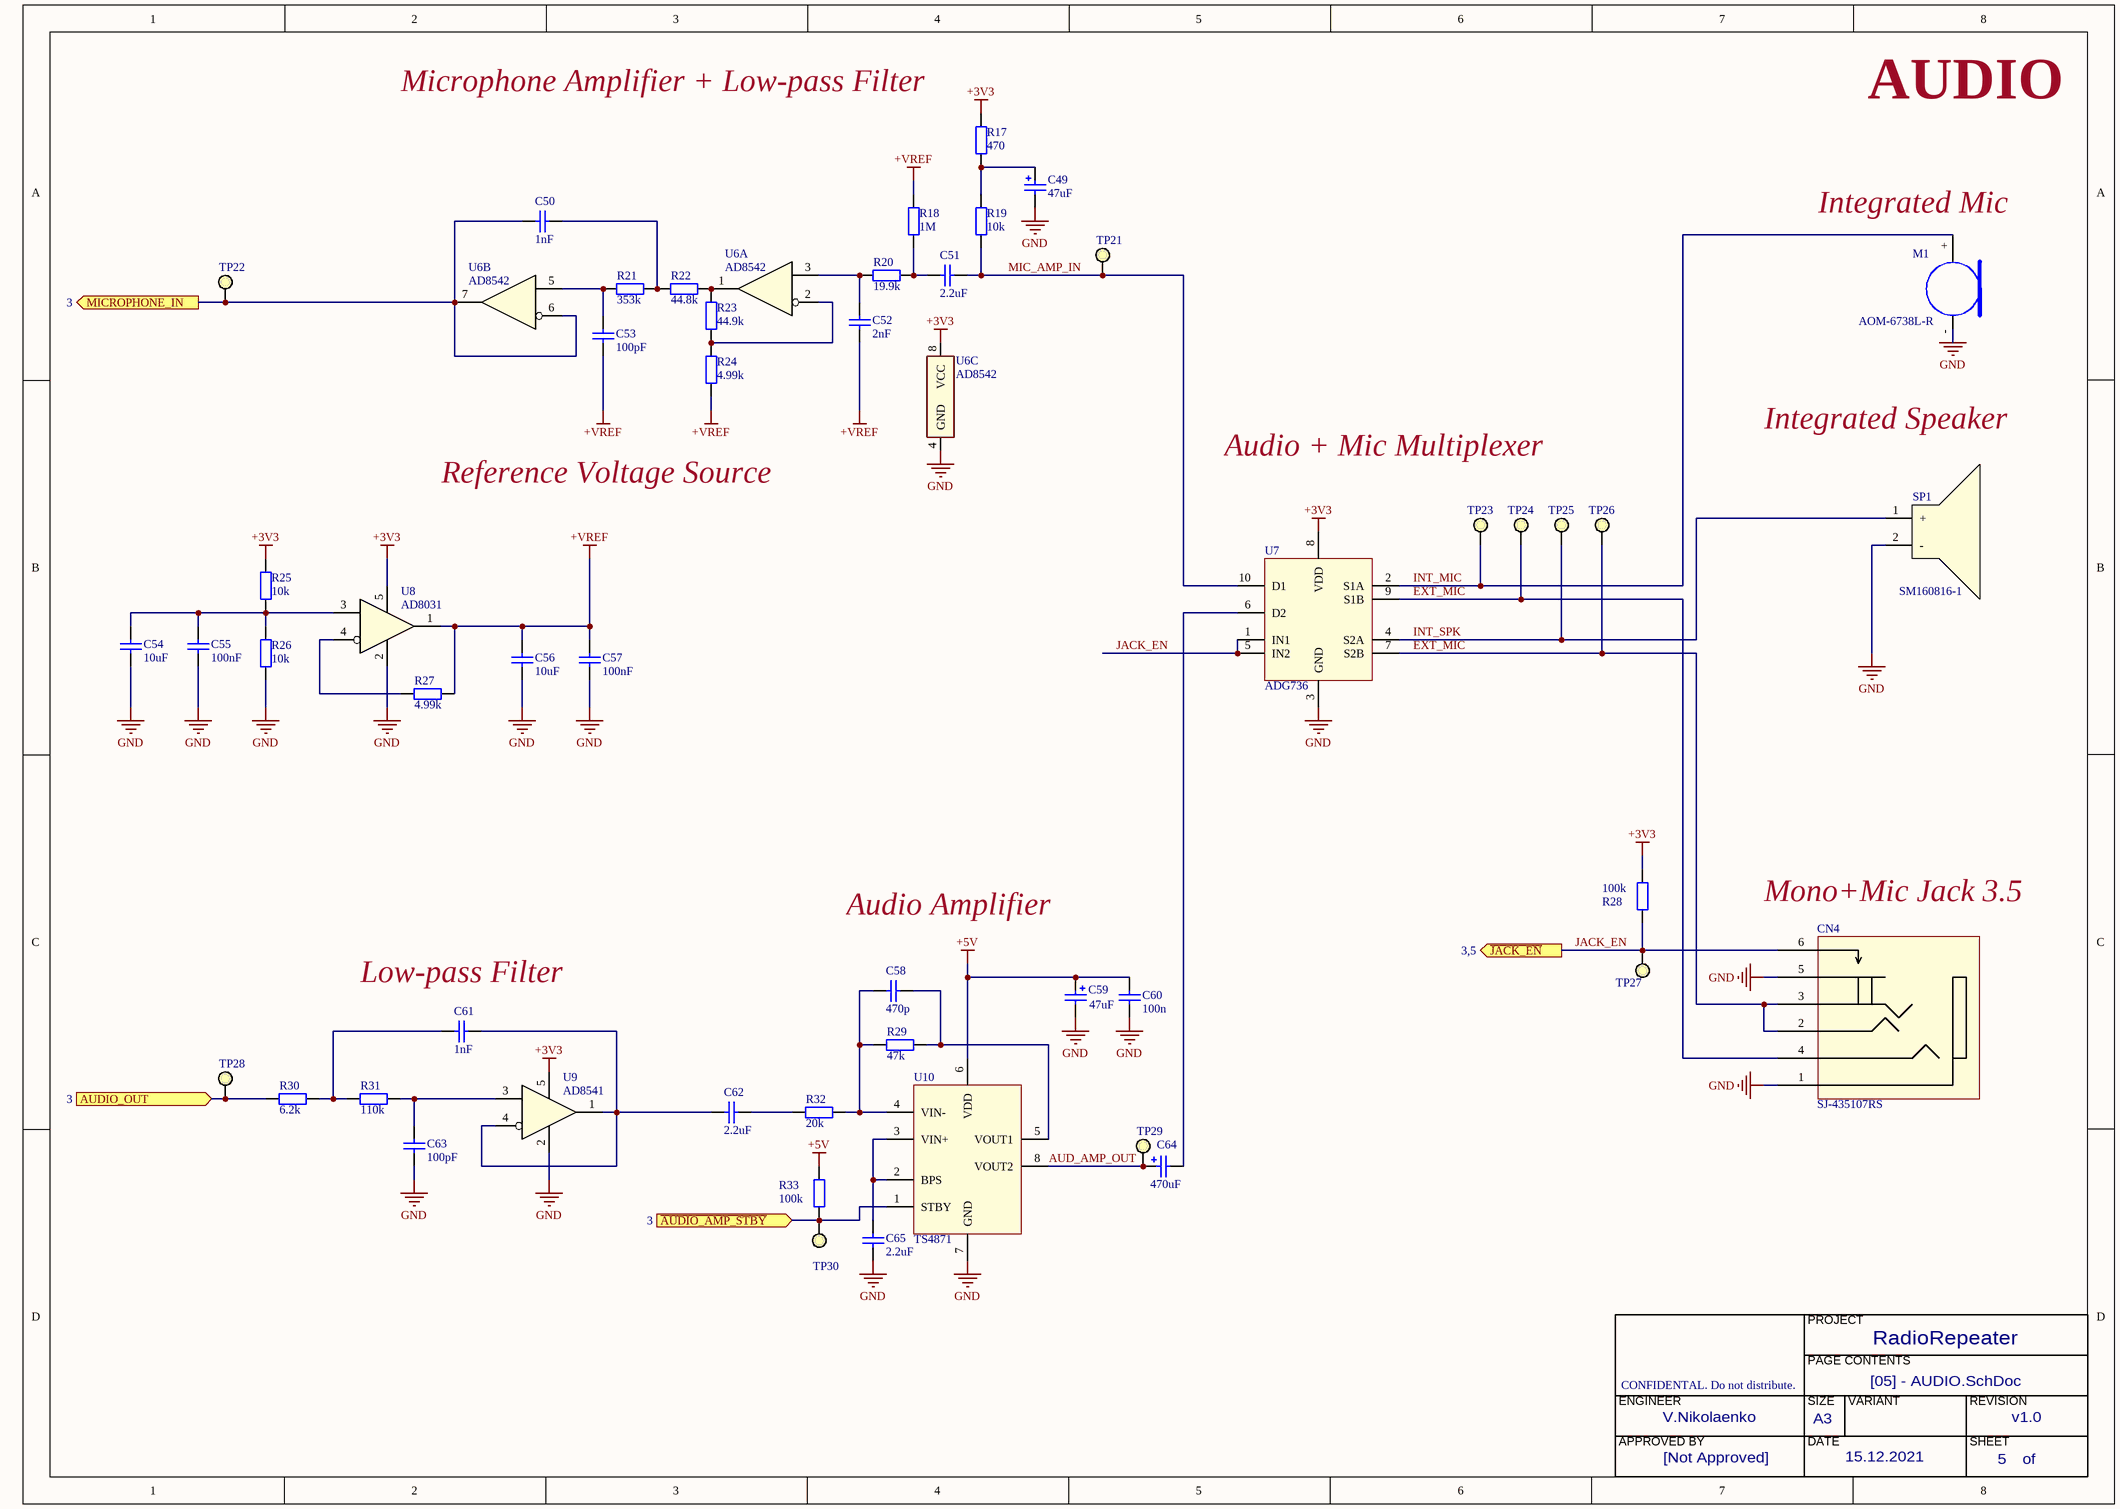
[diagram p6: [05] - AUDIO.SchDoc]

### Parts
C49  47uF  [CAPPR2-4x6.8]
C50  1nF  [CAP0402]
C51  2.2uF  [CAP0402]
C52  2nF  [CAP0402]
C53  100pF  [CAP0402]
C54  10uF  [CAP0402]
C55  100nF  [CAP0402]
C56  10uF  [CAP0402]
C57  100nF  [CAP0402]
C58  470p  [CAP0402]
C59  47uF  [CAPPR2-4x6.8]
C60  100n  [CAP0402]
C61  1nF  [CAP0402]
C62  2.2uF  [CAP0402]
C63  100pF  [CAP0402]
C64  470uF  [CAPPR2-4x6.8]
C65  2.2uF  [CAP0402]
CN4  SJ-435107RS
M1  AOM-6738L-R
R17  470  [RES0402]
R18  1M  [RES0402]
R19  10k  [RES0402]
R20  19.9k  [RES0402]
R21  353k  [RES0402]
R22  44.8k  [RES0402]
R23  44.9k  [RES0402]
R24  4.99k  [RES0402]
R25  10k  [RES0402]
R26  10k  [RES0402]
R27  4.99k  [RES0402]
R28  100k  [RES0402]
R29  47k  [RES0402]
R30  6.2k  [RES0402]
R31  110k  [RES0402]
R32  20k  [RES0402]
R33  100k  [RES0402]
SP1  SM160816-1
TP21  TestPoint  [TestPoint]  (value not drawn)  (no BOM)
TP22  TestPoint  [TestPoint]  (value not drawn)  (no BOM)
TP23  TestPoint  [TestPoint]  (value not drawn)  (no BOM)
TP24  TestPoint  [TestPoint]  (value not drawn)  (no BOM)
TP25  TestPoint  [TestPoint]  (value not drawn)  (no BOM)
TP26  TestPoint  [TestPoint]  (value not drawn)  (no BOM)
TP27  TestPoint  [TestPoint]  (value not drawn)  (no BOM)
TP28  TestPoint  [TestPoint]  (value not drawn)  (no BOM)
TP29  TestPoint  [TestPoint]  (value not drawn)  (no BOM)
TP30  TestPoint  [TestPoint]  (value not drawn)  (no BOM)
U6  AD8542  [SOIC8]  (parts A,B,C of 3)
U7  ADG736
U8  AD8031  [SOT23-5_PITCH0.95]
U9  AD8541  [SOT23-5_PITCH0.95]
U10  TS4871

### Ports
AUDIO_OUT (in, see 3), MICROPHONE_IN (out, see 3), ~{AUDIO_AMP_STBY} (in, see 3), ~{JACK_EN} (out, see 3,5)

### Nets
+3V3: R17.2 R25.2 R28.1 U6.8(VCC) U7.8(VDD) U8.5(VCC+) U9.5(VCC+)
+5V: C59.1 C60.2 R33.1 U10.6(VDD)
+VREF: C52.1 C53.1 C56.2 C57.2 R18.2 R24.1 R27.1 U8.1(OUT)
GND: C49.2 C54.1 C55.1 C56.1 C57.1 C59.2 C60.1 C63.1 C65.1 CN4.1 CN4.5 M1.- R26.1 SP1.2(-) U6.4(GND) U7.3(GND) U8.2(VCC-) U9.2(VCC-) U10.7(GND)
~{AUDIO_AMP_STBY}: R33.2 TP30.1 U10.1(STBY) ; port ~{AUDIO_AMP_STBY}
AUD_AMP_OUT: C64.1 TP29.1 U10.8(VOUT2)  [project net AUD_AMP_OUT_5]
AUDIO_OUT: R30.1 TP28.1 ; port AUDIO_OUT
EXT_MIC: CN4.2 CN4.3 CN4.4 TP24.1 TP26.1 U7.7(S2B) U7.9(S1B)  [project net EXT_MIC_5]
INT_MIC: M1.+ TP23.1 U7.2(S1A)  [project net INT_MIC_5]
INT_SPK: SP1.1(+) TP25.1 U7.4(S2A)  [project net INT_SPK_5]
JACK_EN: CN4.6 R28.2 TP27.1 U7.1(IN1) U7.5(IN2) ; port ~{JACK_EN}
MIC_AMP_IN: C51.1 R19.1 TP21.1 U7.10(D1)  [project net MIC_AMP_IN_5]
MICROPHONE_IN: C50.2 TP22.1 U6.6(IN-) U6.7(OUT) ; port MICROPHONE_IN
NetC49_1: C49.1 R17.1 R19.2
NetC50_1: C50.1 R21.2 R22.1
NetC51_2: C51.2 R18.1 R20.2
NetC52_2: C52.2 R20.1 U6.3(IN+)
NetC53_2: C53.2 R21.1 U6.5(IN+)
NetC54_2: C54.2 C55.2 R25.1 R26.2 U8.3(IN+)
NetC58_1: C58.1 R29.2 R32.1 U10.4(VIN-)
NetC58_2: C58.2 R29.1 U10.5(VOUT1)
NetC61_1: C61.1 R30.2 R31.1
NetC61_2: C61.2 C62.1 U9.1(OUT) U9.4(IN-)
NetC62_2: C62.2 R32.2
NetC63_2: C63.2 R31.2 U9.3(IN+)
NetC64_2: C64.2 U7.6(D2)
NetC65_2: C65.2 U10.2(BPS) U10.3(VIN+)
NetR22_2: R22.2 R23.2 U6.1(OUT)
NetR23_1: R23.1 R24.2 U6.2(IN-)
NetR27_2: R27.2 U8.4(IN-)

### Notes on the sheet
- (near R17) Microphone Amplifier + Low-pass Filter
- AUDIO
- (near M1) Integrated Mic
- Integrated Speaker
- Reference Voltage Source
- Audio + Mic Multiplexer
- Audio Amplifier
- (near CN4) Mono+Mic Jack 3.5
- (near C61) Low-pass Filter
- PROJECT
- CONFIDENTAL. Do not distribute.
- PAGE CONTENTS
- ENGINEER
- APPROVED BY
- SIZE
- DATE
- A3
- VARIANT
- REVISION
- SHEET
- of

### Library data of the parts
C49 C59 C64 = Cap Pol: Polarized Capacitor; Manufacturer: *; Manufacturer Part Number: *; Supplier 1: Digi-Key; Supplier Part Number 1: *; Supplier Price 1: *
C50-C58 C60-C63 C65 = Cap: Capacitor; Manufacturer: *; Manufacturer Part Number: *; Supplier 1: Digi-Key; Supplier Part Number 1: *
M1 = Microphone
R17-R33 = Res: Resistor; Manufacturer: *; Manufacturer Part Number: *; Supplier 1: Digi-Key; Supplier Part Number 1: *
SP1 = Speaker
U6 = OPAMP x2
U8 U9 = OPAMP x1

## Sheet [06] - POWER.SchDoc
size A3; DocumentNumber: 6; SheetNumber: 6; SheetTotal: 8
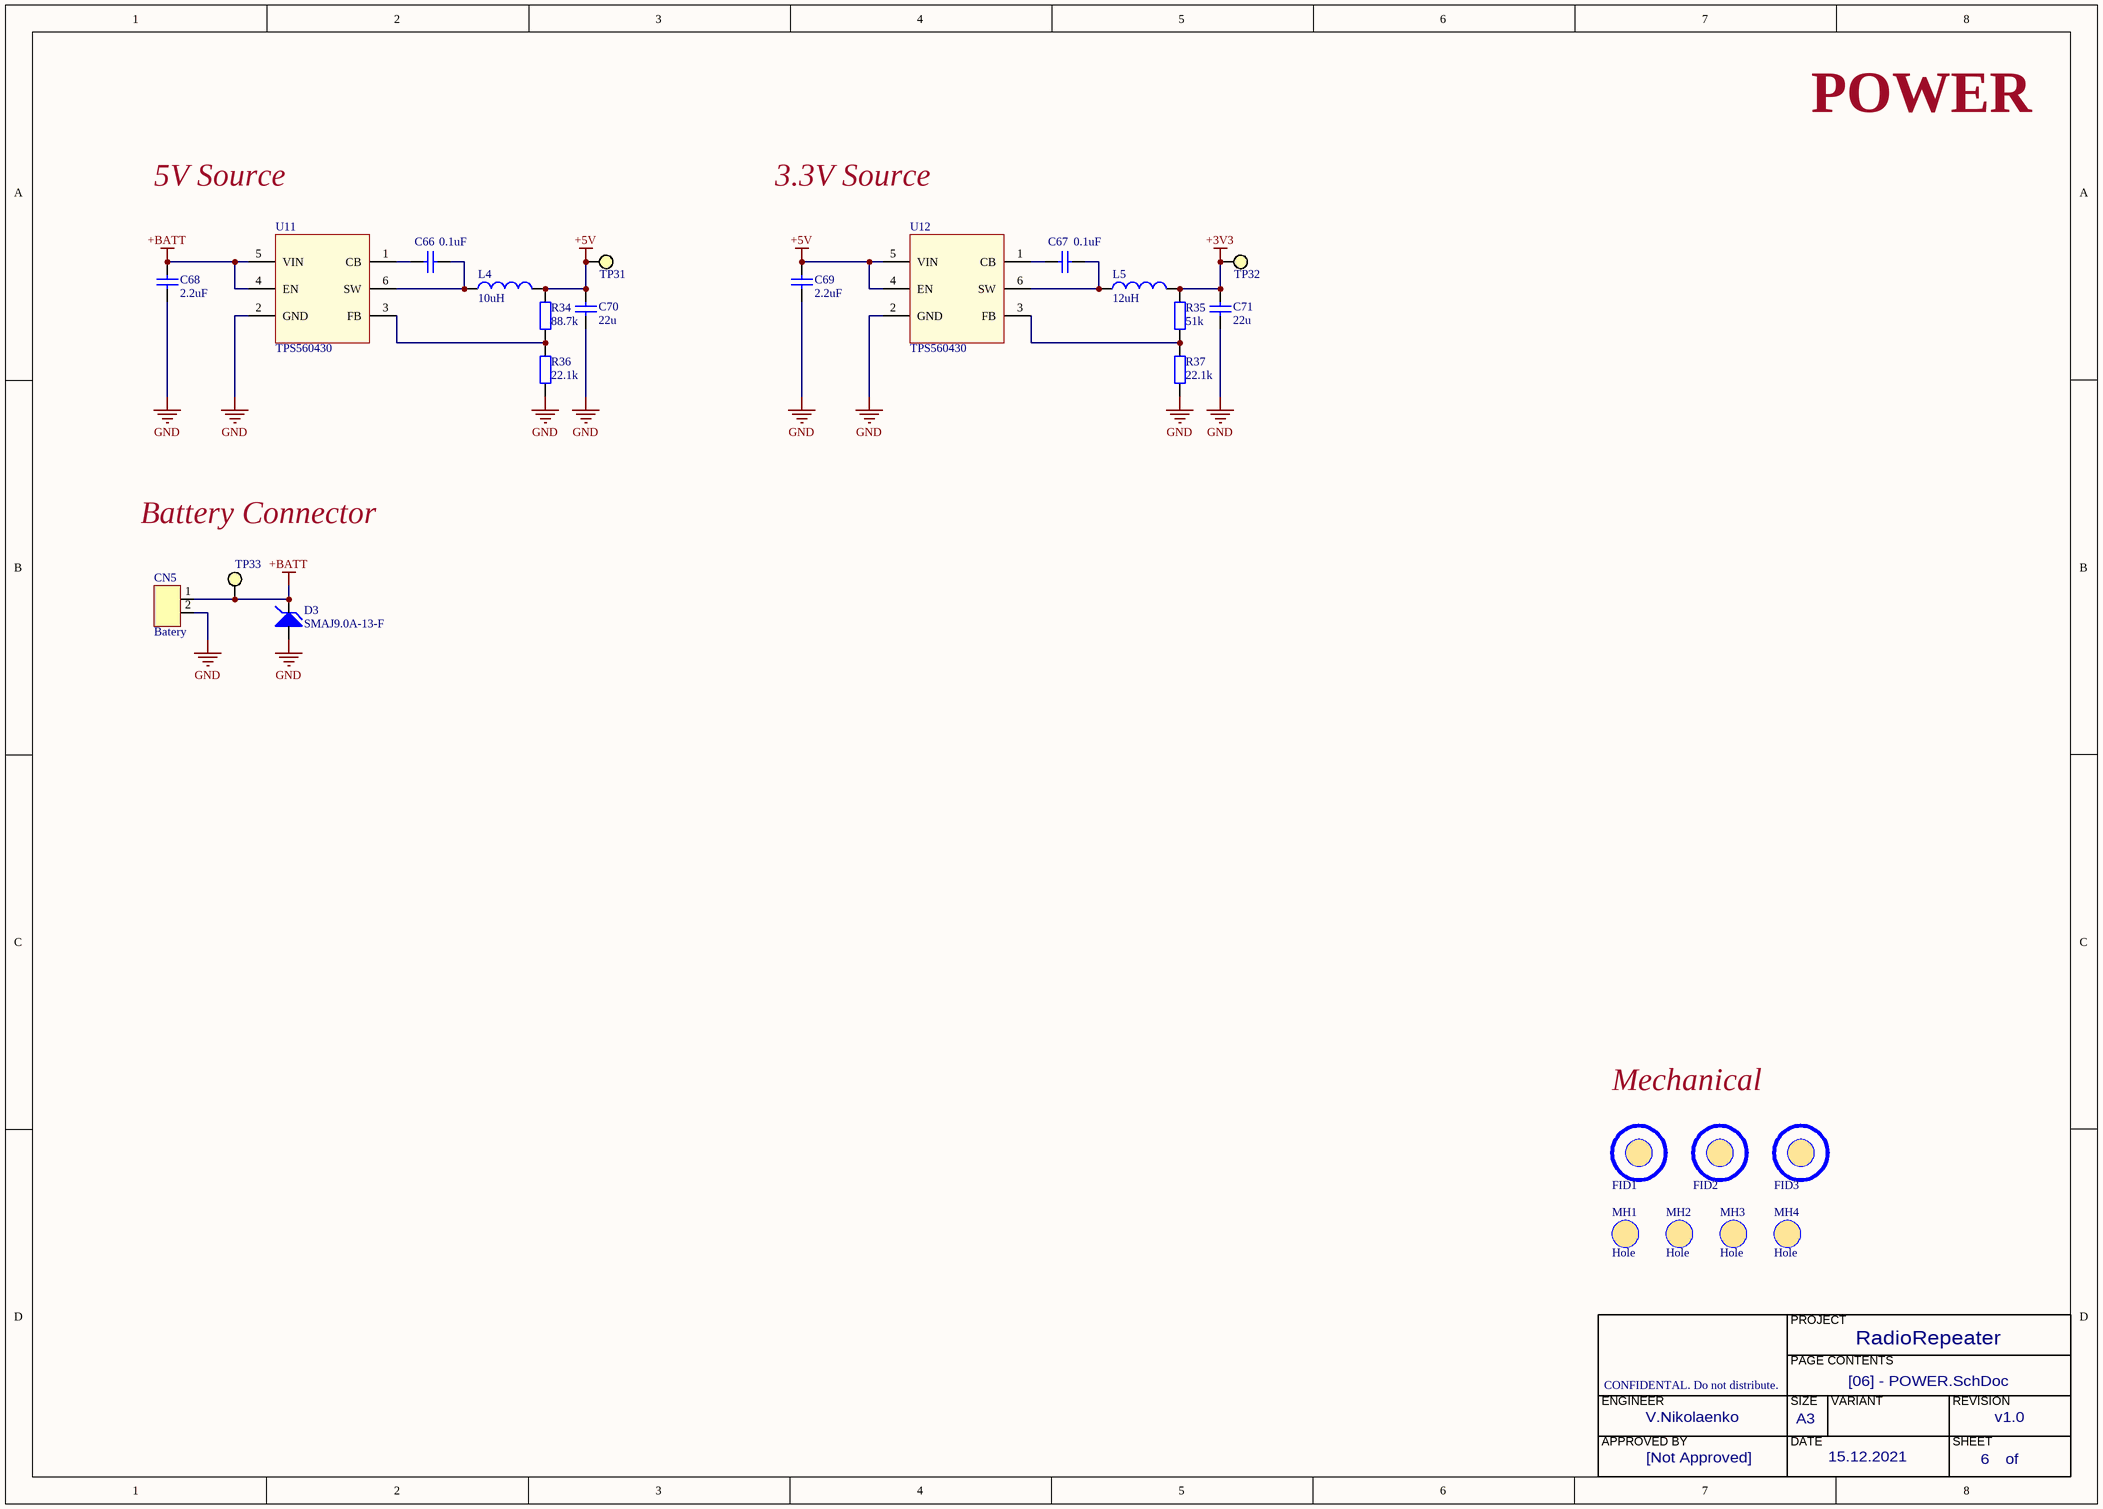
[diagram p7: [06] - POWER.SchDoc]

### Parts
C66  0.1uF  [CAP0402]
C67  0.1uF  [CAP0402]
C68  2.2uF  [CAP0402]
C69  2.2uF  [CAP0402]
C70  22u  [CAP0402]
C71  22u  [CAP0402]
CN5  Batery  [H-D-1x2]
D3  SMAJ9.0A-13-F  [SMB]
FID1  Fiducial  [Fiducial]  (value not drawn)  (no BOM)
FID2  Fiducial  [Fiducial]  (value not drawn)  (no BOM)
FID3  Fiducial  [Fiducial]  (value not drawn)  (no BOM)
L4  10uH  [INDC0603-0201]
L5  12uH  [INDC0603-0201]
MH1  Hole  (no BOM)
MH2  Hole  (no BOM)
MH3  Hole  (no BOM)
MH4  Hole  (no BOM)
R34  88.7k  [RES0402]
R35  51k  [RES0402]
R36  22.1k  [RES0402]
R37  22.1k  [RES0402]
TP31  TestPoint  [TestPoint]  (value not drawn)  (no BOM)
TP32  TestPoint  [TestPoint]  (value not drawn)  (no BOM)
TP33  TestPoint  [TestPoint]  (value not drawn)  (no BOM)
U11  TPS560430
U12  TPS560430

### Nets
+3V3: C71.1 L5.2 R35.1 TP32.1
+5V: C69.2 C70.1 L4.2 R34.1 TP31.1 U12.4(EN) U12.5(VIN)
+BATT: C68.2 CN5.1 D3.C TP33.1 U11.4(EN) U11.5(VIN)
GND: C68.1 C69.1 C70.2 C71.2 CN5.2 D3.A R36.1 R37.1 U11.2(GND) U12.2(GND)
NetC66_1: C66.1 L4.1 U11.6(SW)
NetC66_2: C66.2 U11.1(CB)
NetC67_1: C67.1 L5.1 U12.6(SW)
NetC67_2: C67.2 U12.1(CB)
NetR34_2: R34.2 R36.2 U11.3(FB)
NetR35_2: R35.2 R37.2 U12.3(FB)

### Notes on the sheet
- POWER
- 5V Source
- 3.3V Source
- Battery Connector
- Mechanical
- PROJECT
- CONFIDENTAL. Do not distribute.
- PAGE CONTENTS
- ENGINEER
- APPROVED BY
- SIZE
- DATE
- A3
- VARIANT
- REVISION
- SHEET
- of

### Library data of the parts
C66-C71 = Cap: Capacitor; Manufacturer: *; Manufacturer Part Number: *; Supplier 1: Digi-Key; Supplier Part Number 1: *
CN5 = CONN-1x2pin: Connector 1x2; Manufacturer: *; Manufacturer Part Number: *; Supplier 1: Digi-Key; Supplier Part Number 1: *
D3 = Diode_TVS_Uni: TVS DIODE
L4 L5 = Inductor: DigiKey: *
R34-R37 = Res: Resistor; Manufacturer: *; Manufacturer Part Number: *; Supplier 1: Digi-Key; Supplier Part Number 1: *

## Nets that join several sheets
+3V3: [03] - WIRELESS MCU,CONTROLS (18 pins), [04] - RADIO (U2.5), [05] - AUDIO (7 pins), [06] - POWER (C71.1 L5.2 R35.1 TP32.1)
+5V: [04] - RADIO (20 pins), [05] - AUDIO (C59.1 C60.2 R33.1 U10.6), [06] - POWER (7 pins)
GND: [03] - WIRELESS MCU,CONTROLS (37 pins), [04] - RADIO (27 pins), [05] - AUDIO (19 pins), [06] - POWER (10 pins)
~{AUDIO_AMP_STBY}: [03] - WIRELESS MCU,CONTROLS (U1.21), [05] - AUDIO (R33.2 TP30.1 U10.1)
AUDIO_OUT: [03] - WIRELESS MCU,CONTROLS (U1.36), [05] - AUDIO (R30.1 TP28.1)
JACK_EN: [03] - WIRELESS MCU,CONTROLS (U1.20), [05] - AUDIO (5 pins)
MICROPHONE_IN: [03] - WIRELESS MCU,CONTROLS (U1.38), [05] - AUDIO (C50.2 TP22.1 U6.6 U6.7)
RF_AMP_BYPASS: [03] - WIRELESS MCU,CONTROLS (U1.29), [04] - RADIO (6 pins)
RF_SUB_1GHZ_N: [03] - WIRELESS MCU,CONTROLS (U1.4), [04] - RADIO (U3.7)
RF_SUB_1GHZ_P: [03] - WIRELESS MCU,CONTROLS (U1.3), [04] - RADIO (U3.9)
RF_TX_AMP: [03] - WIRELESS MCU,CONTROLS (U1.28), [04] - RADIO (10 pins)
RF_TX_PWR_SET: [03] - WIRELESS MCU,CONTROLS (U1.37), [04] - RADIO (C14.2 R2.1 TP1.1)